# EAGLE design Aquila-2018 - コピー (EAGLE 9.1.1)
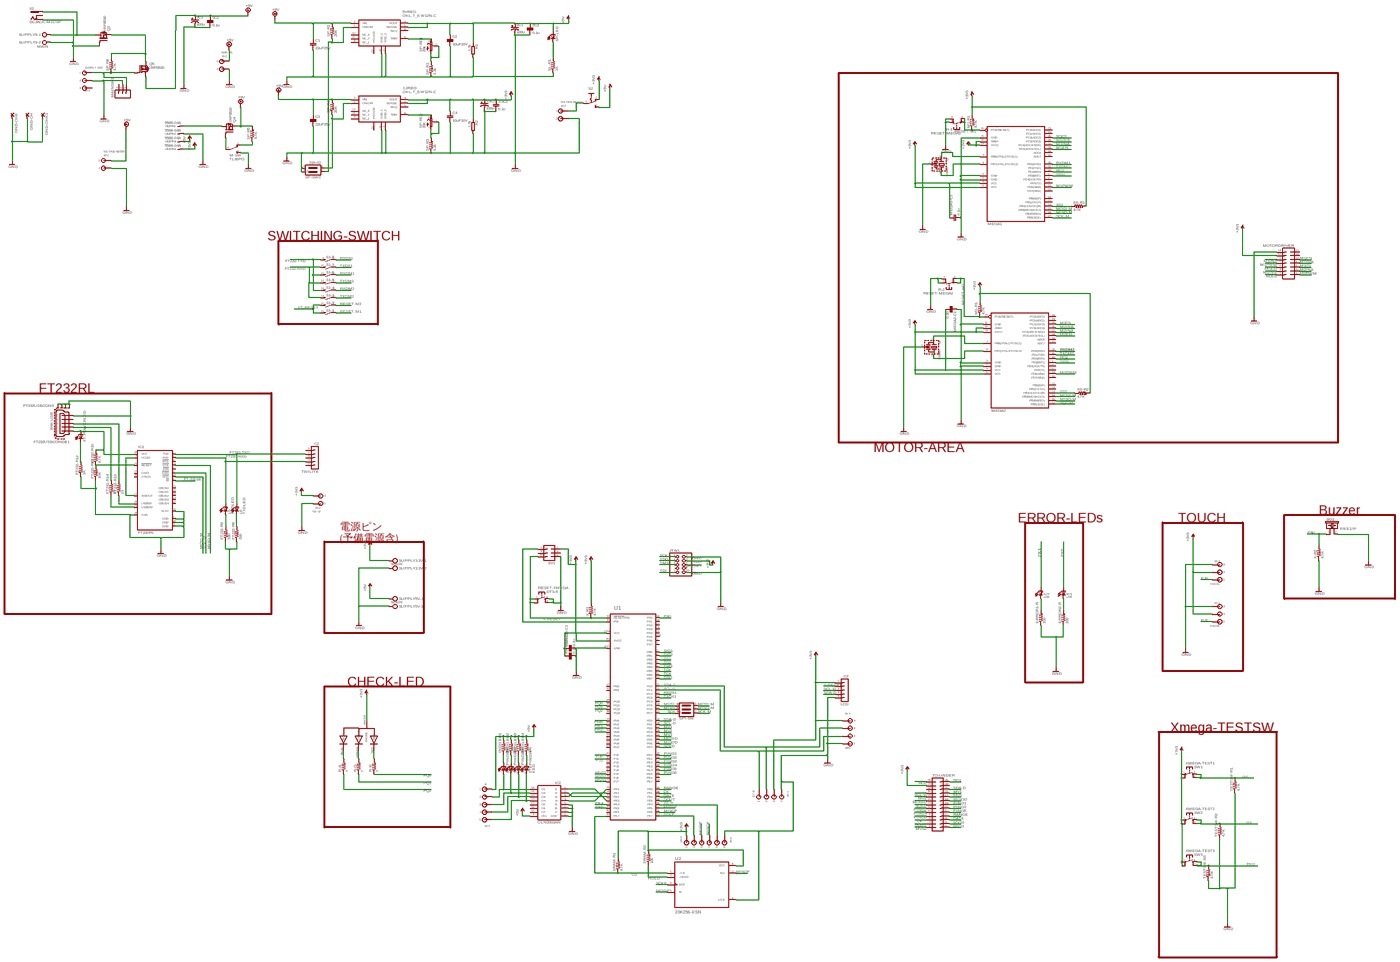
[diagram p0: schematic, sheet 1, overview]
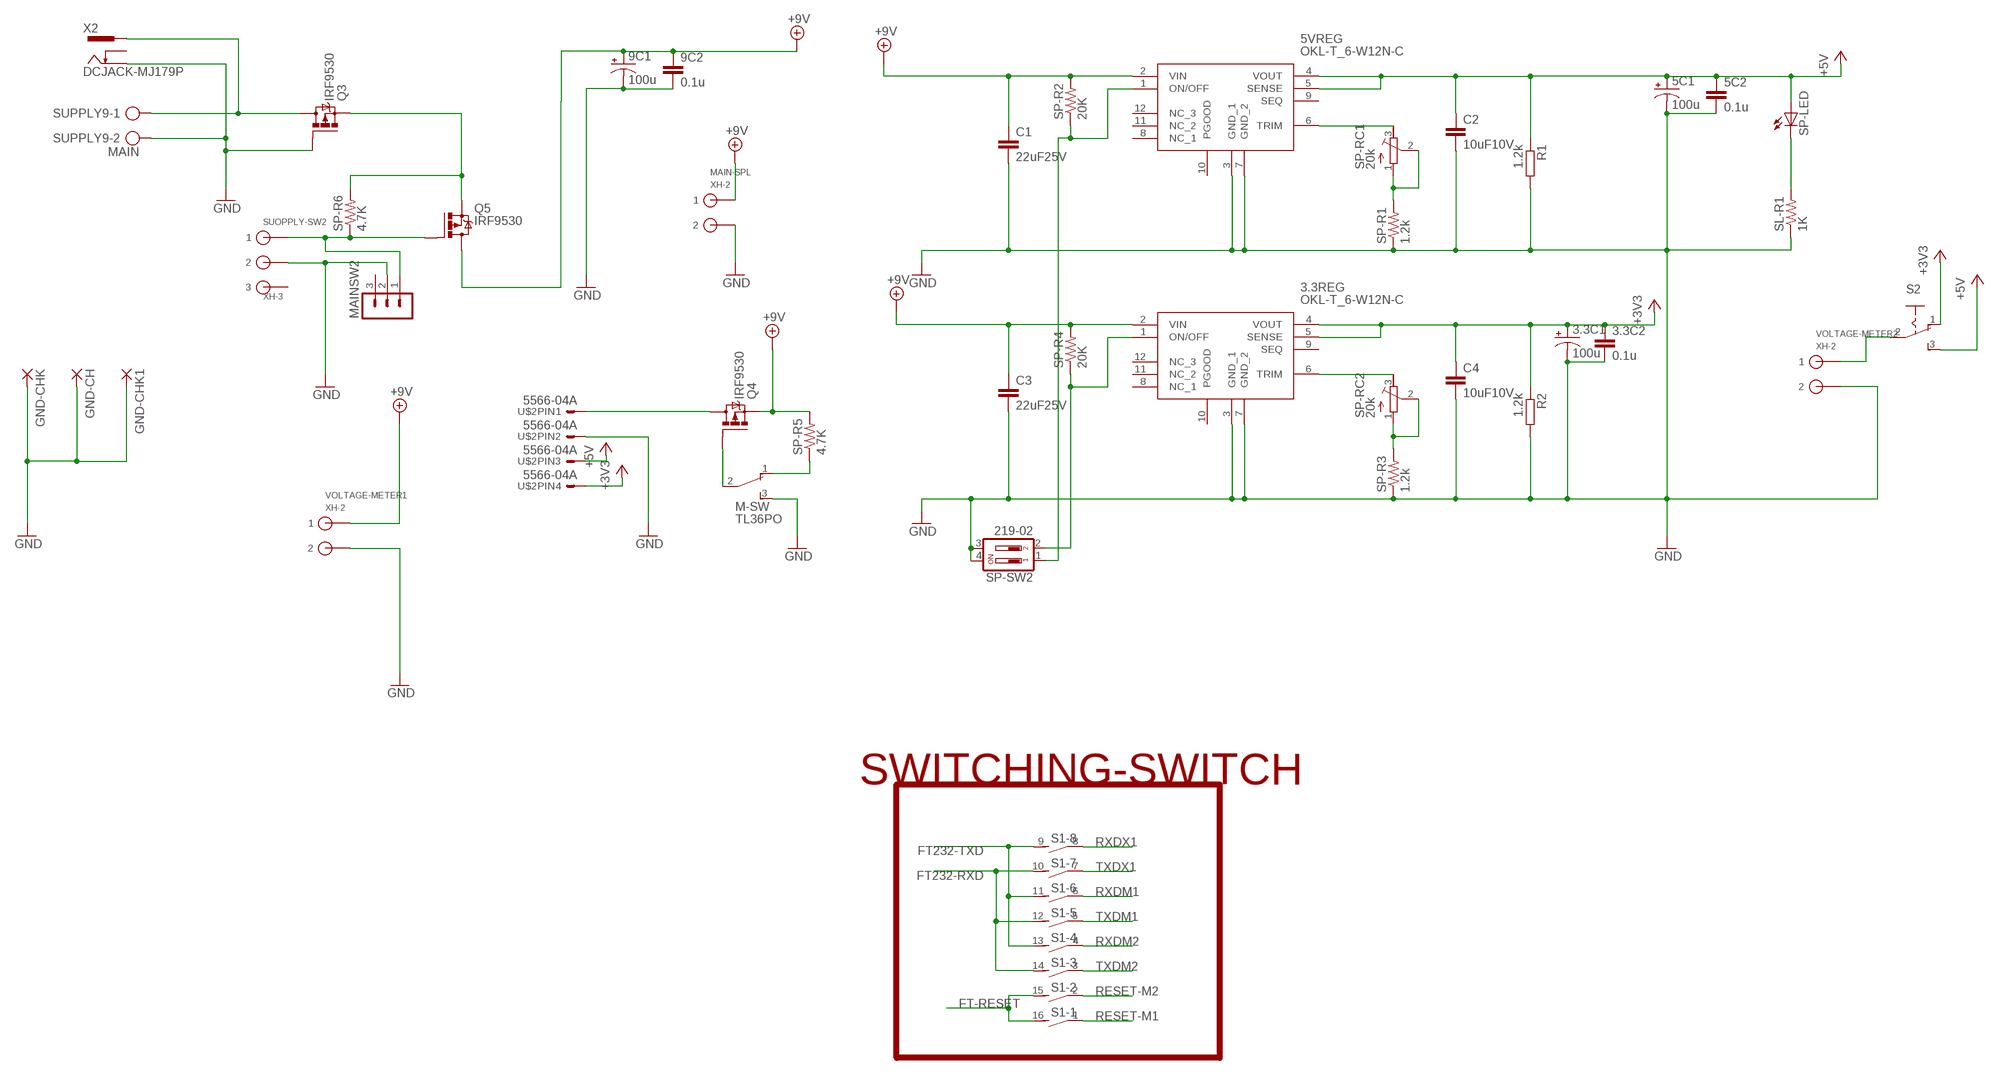
[diagram p1: schematic, sheet 1, part 1 of 5]
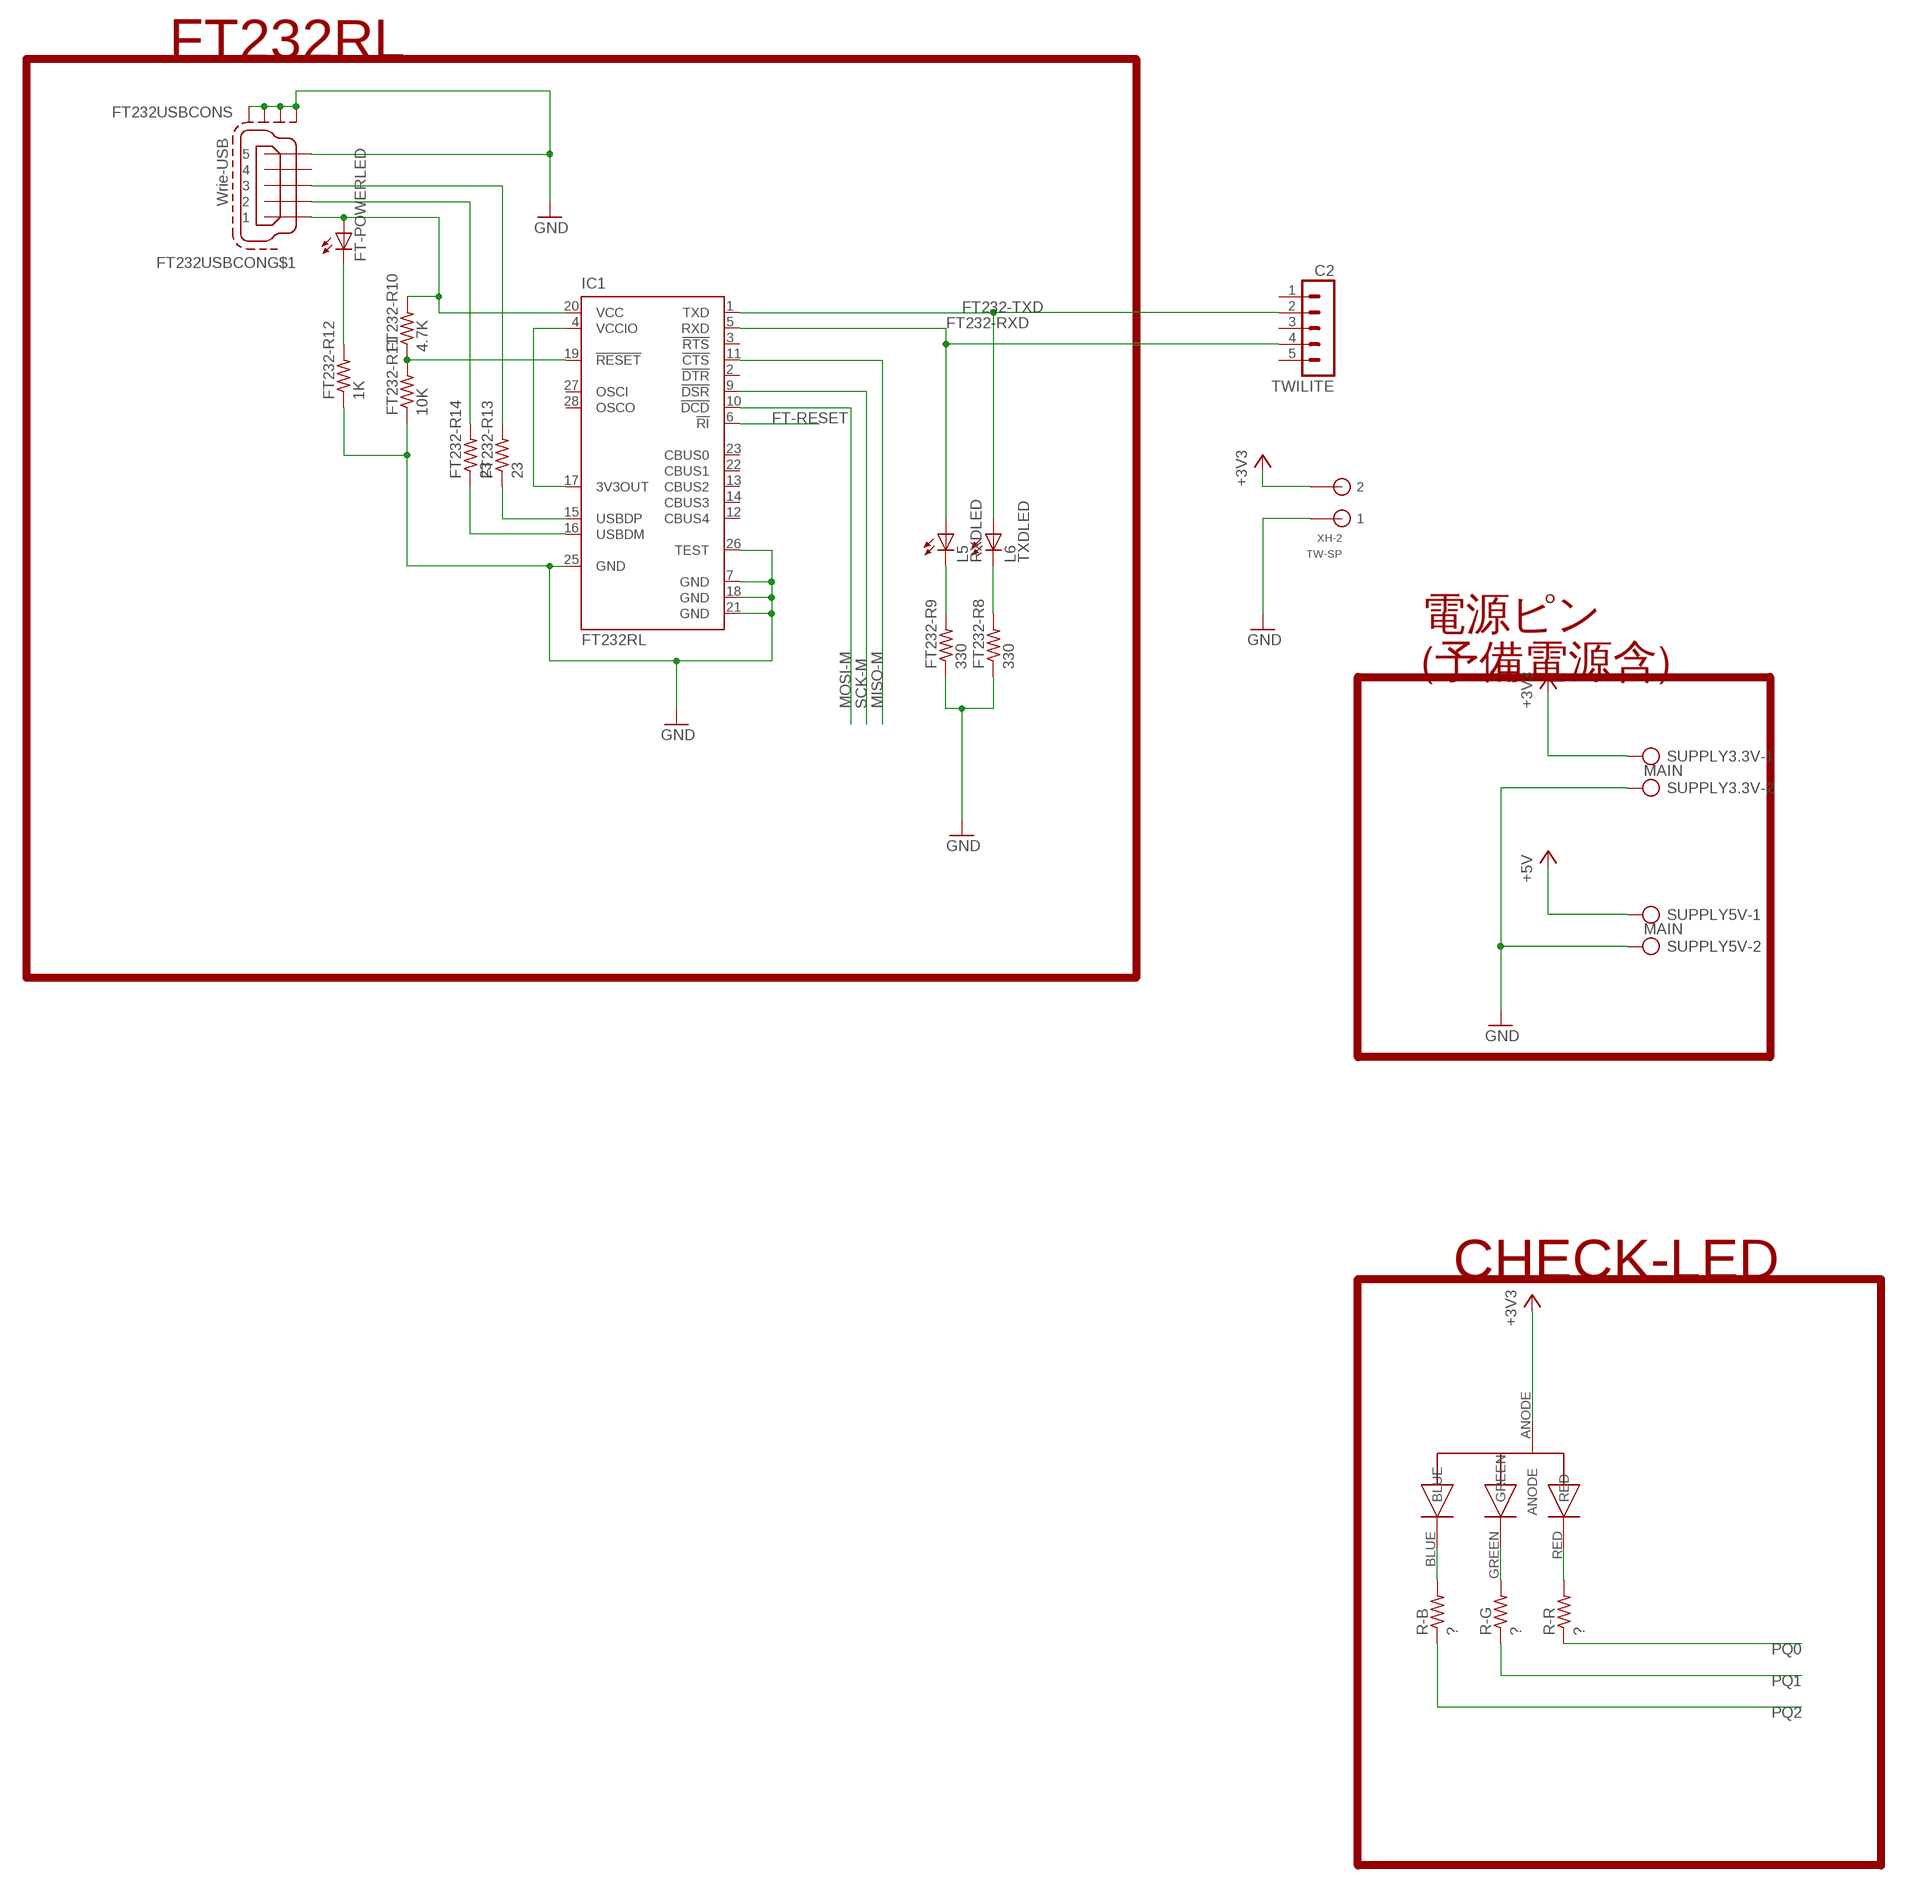
[diagram p2: schematic, sheet 1, part 2 of 5]
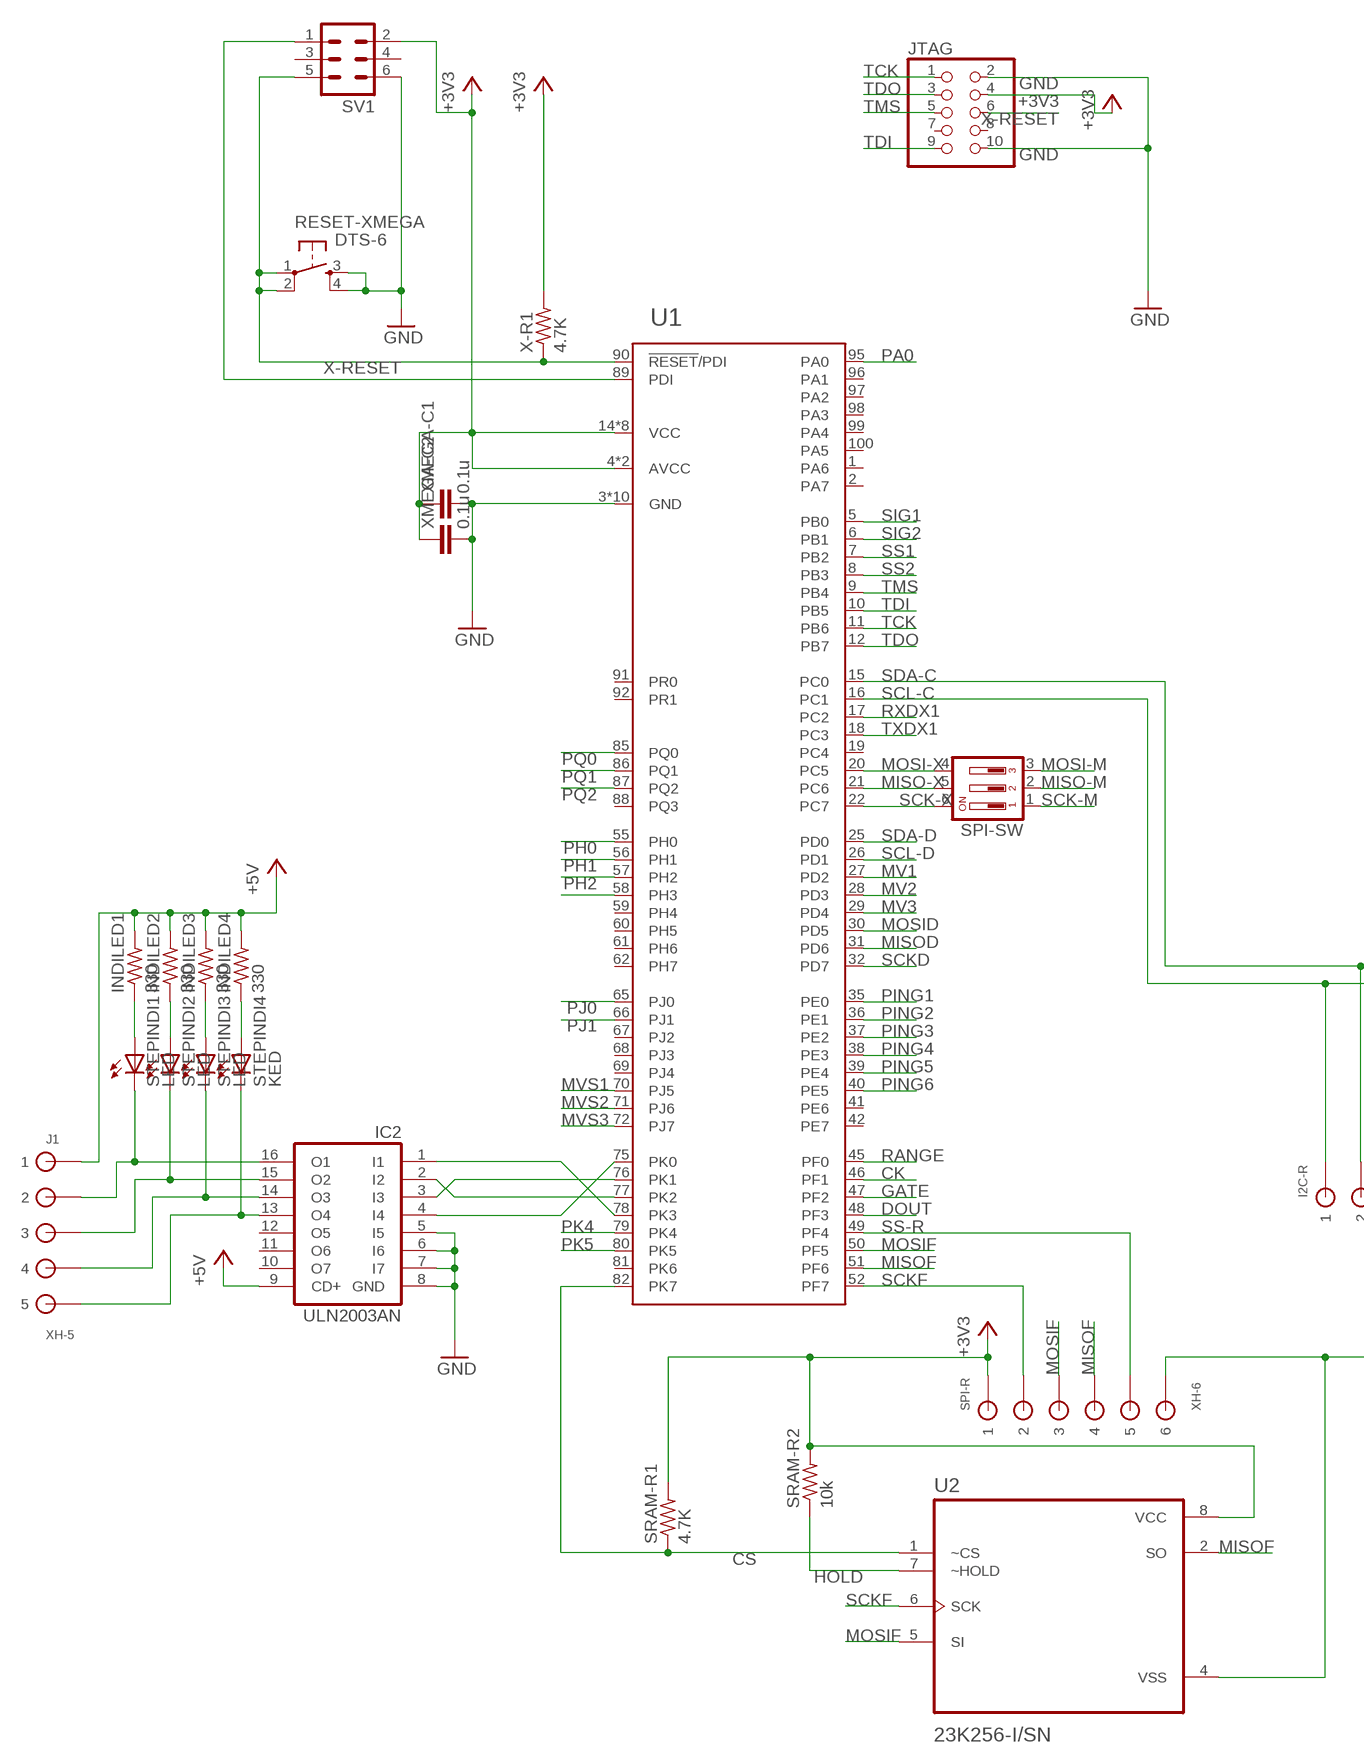
[diagram p3: schematic, sheet 1, part 3 of 5]
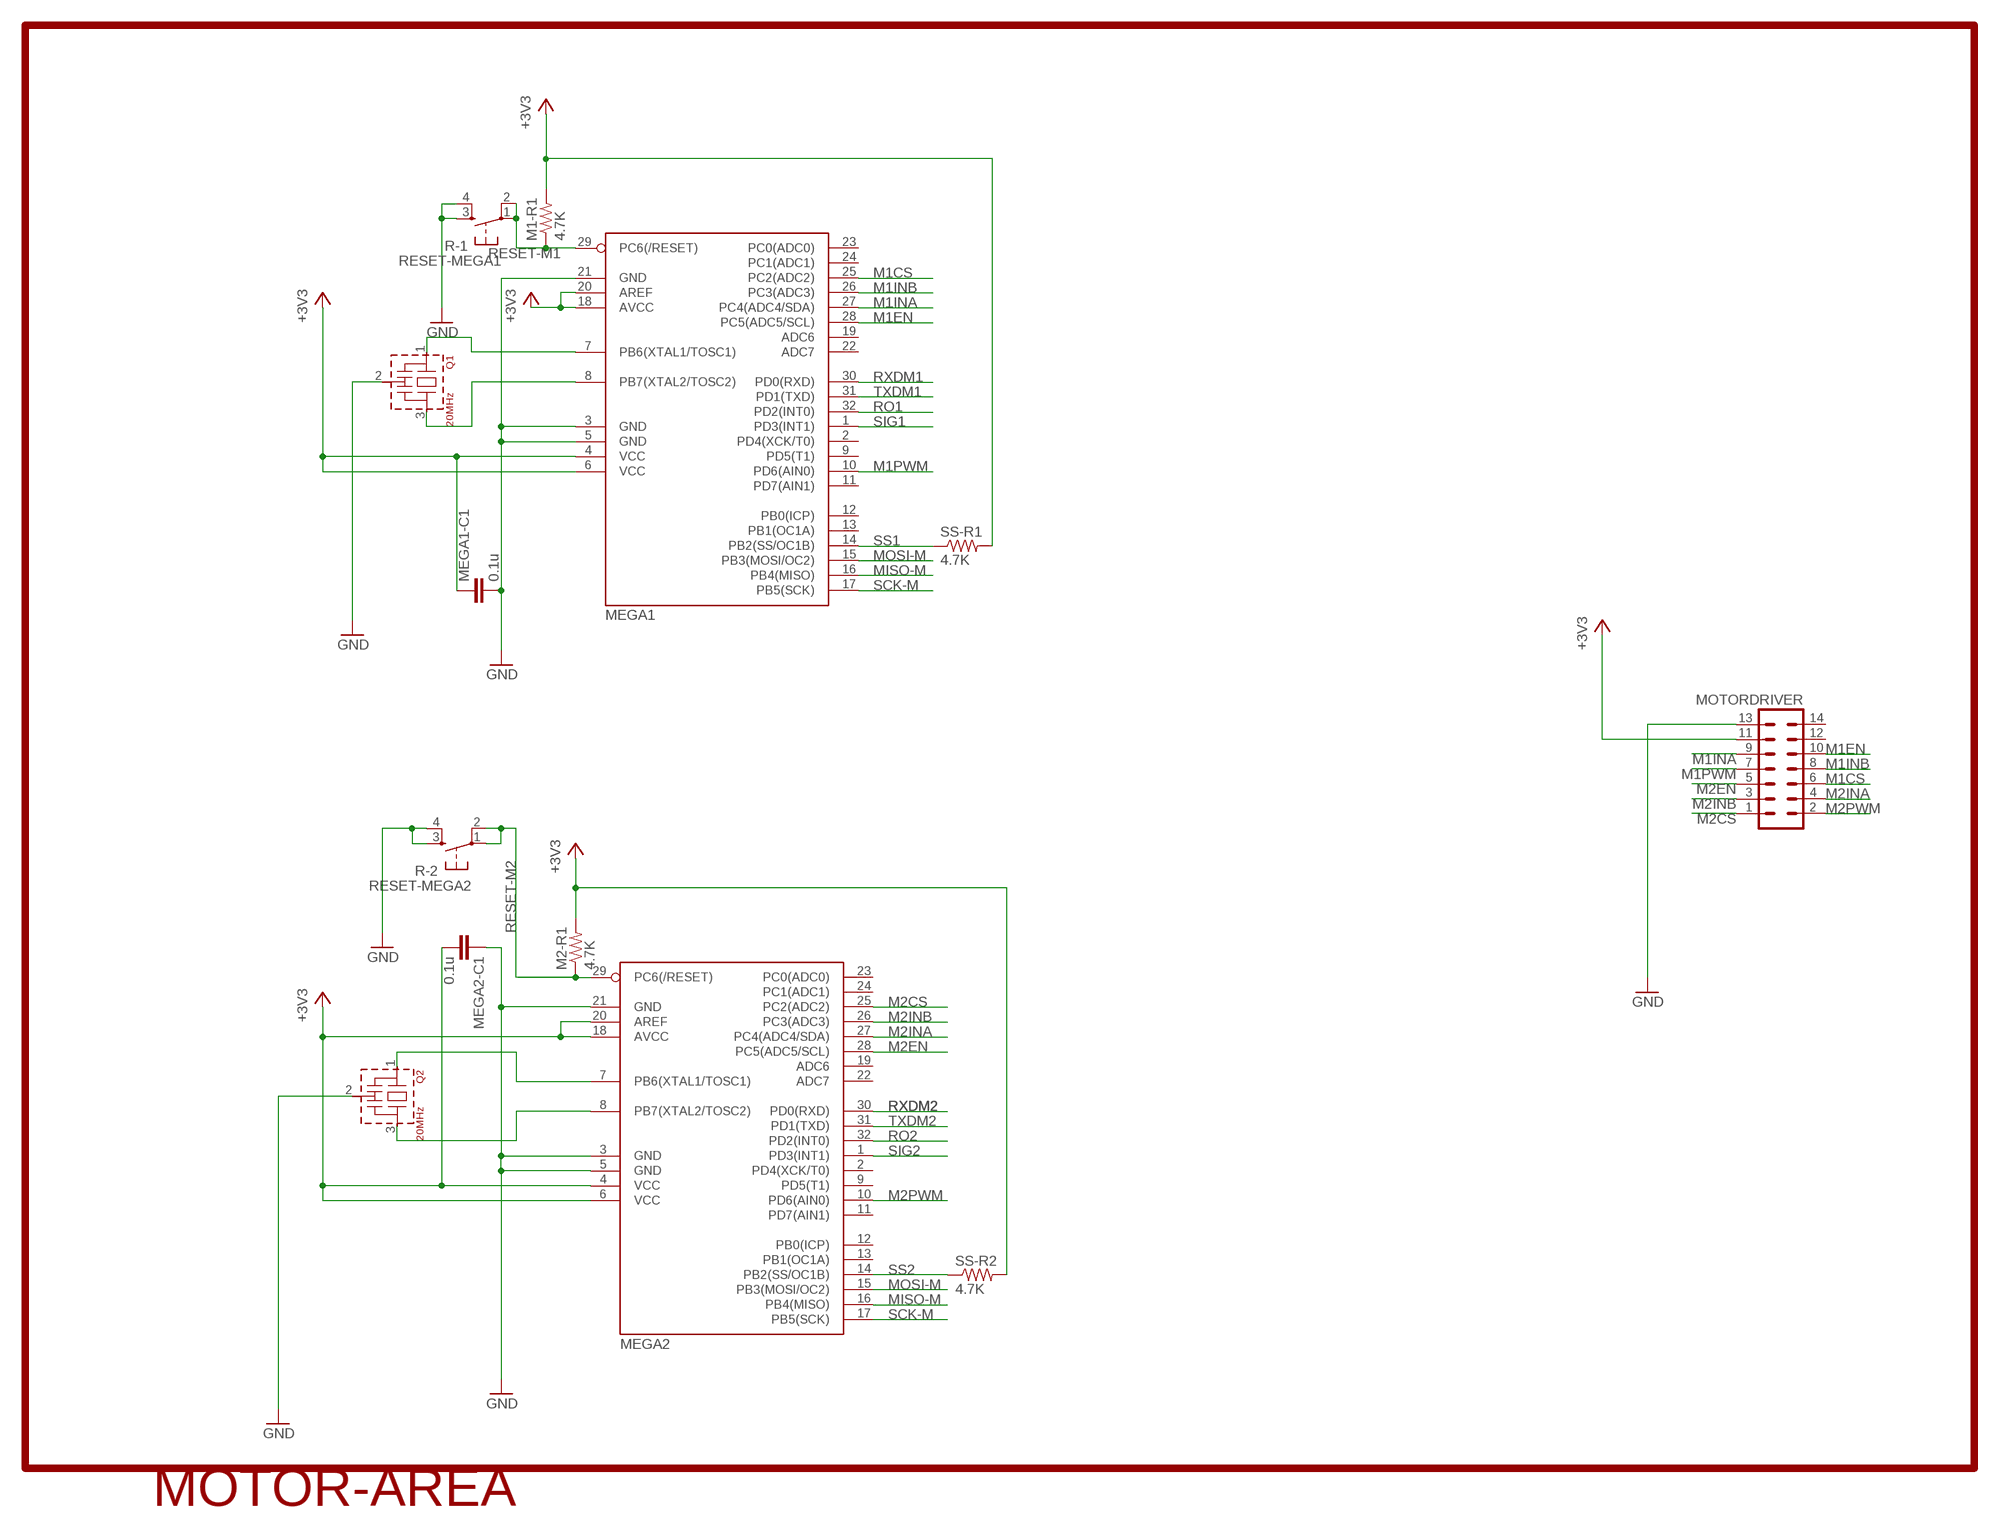
[diagram p4: schematic, sheet 1, part 4 of 5]
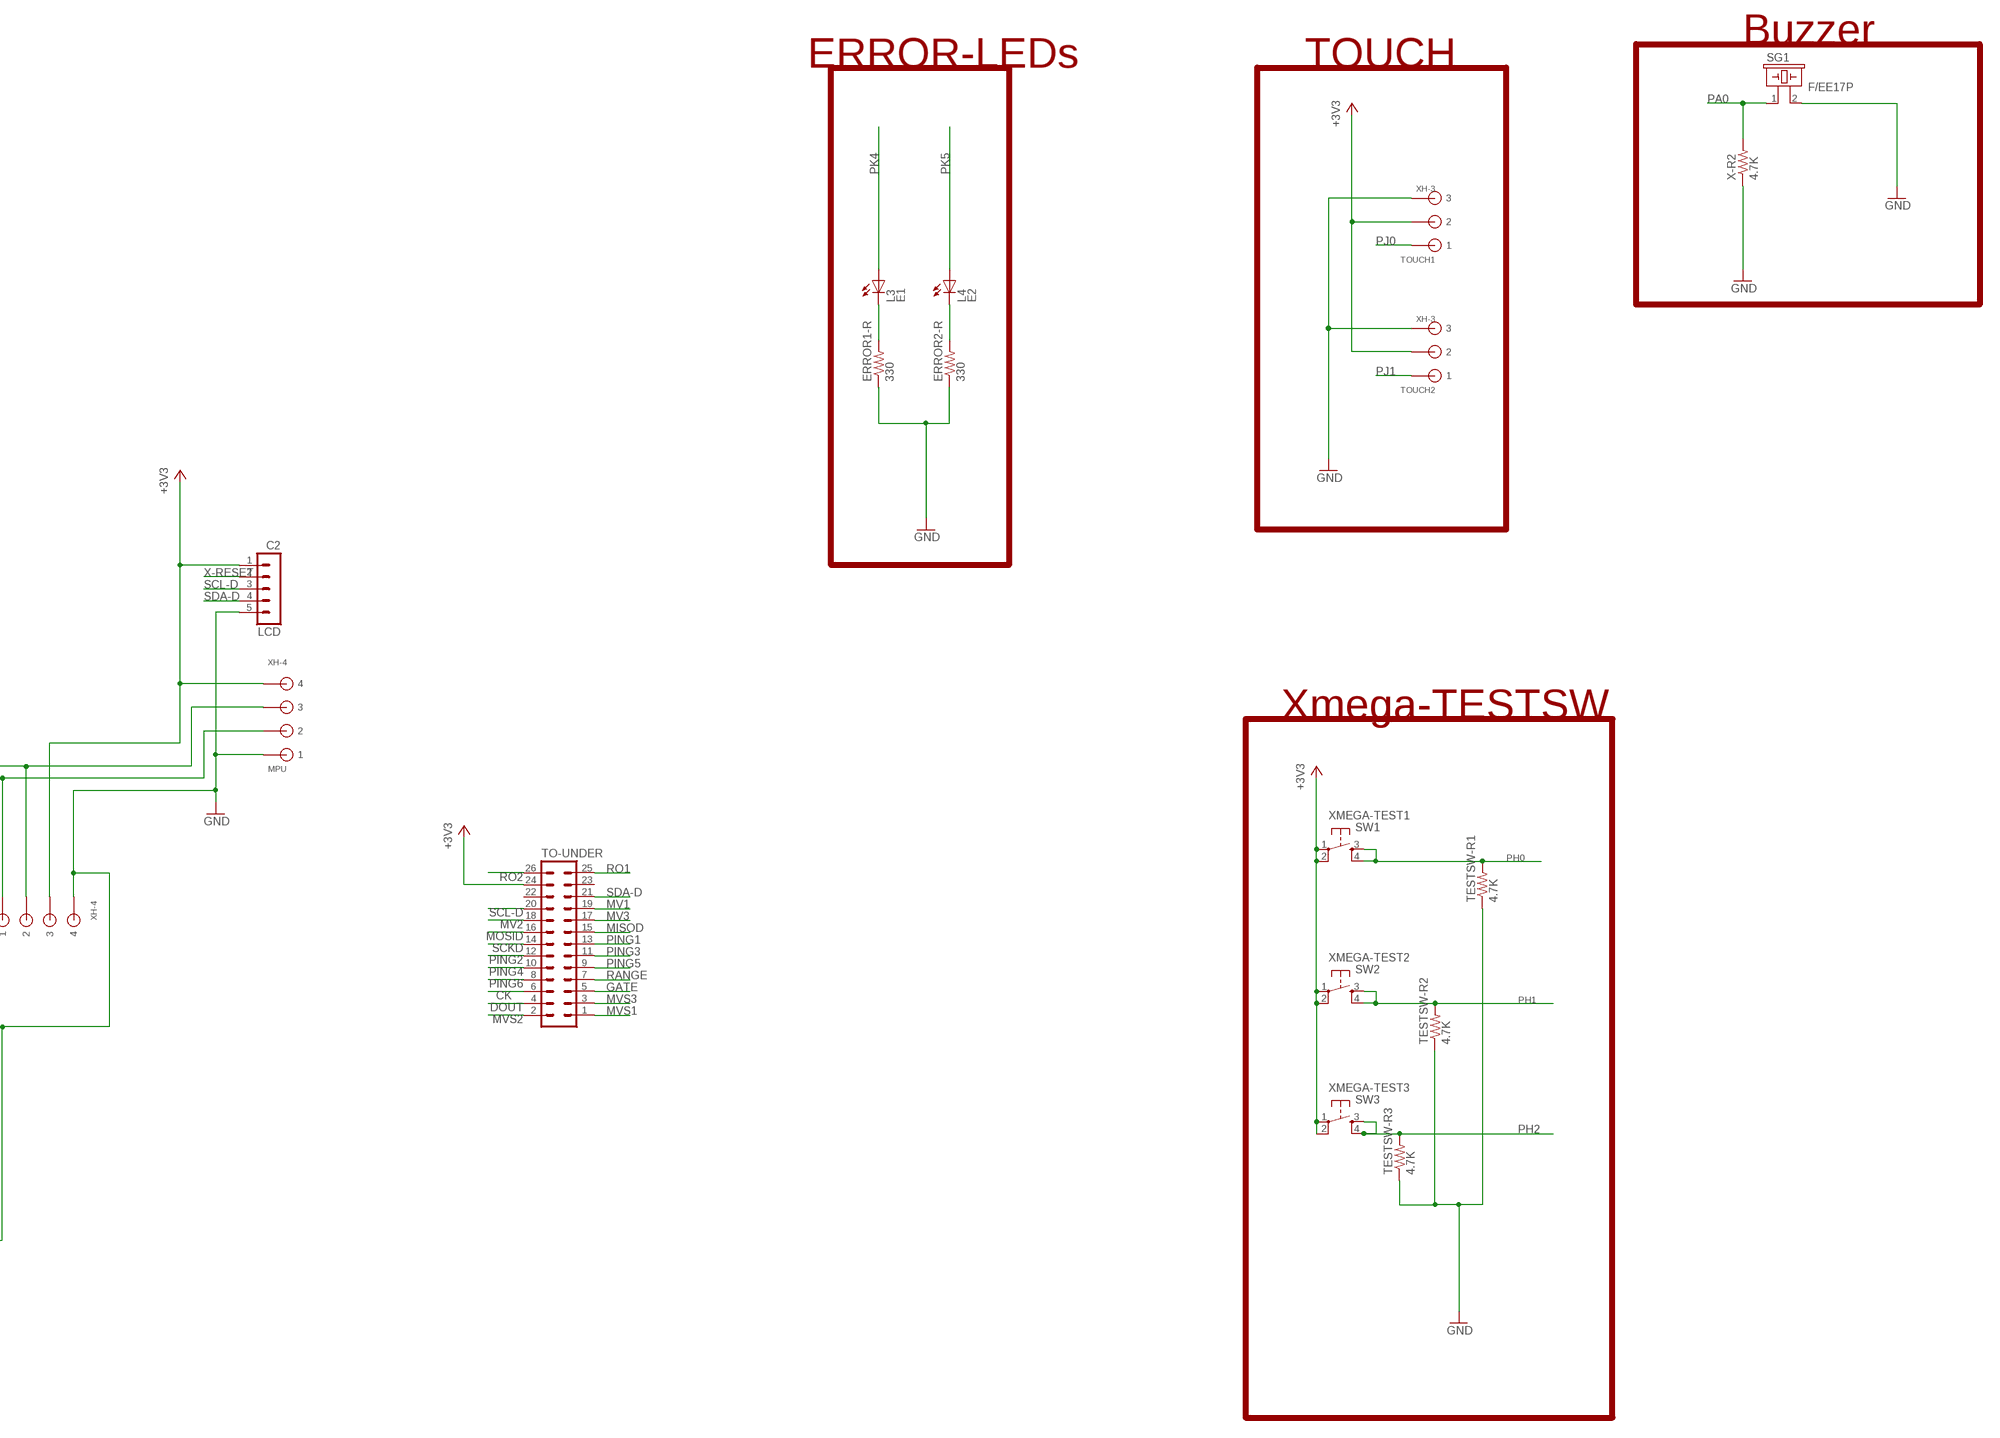
[diagram p5: schematic, sheet 1, part 5 of 5]

## Parts
3.3C1  100u  CPOL-USE2.5-6  [E2,5-6]
3.3C2  0.1u  C-EUC0805  [C0805]
3.3REG  OKL-T_6-W12N-C  [OKL-T/3-W5]
5C1  100u  CPOL-USE2.5-6  [E2,5-6]
5C2  0.1u  C-EUC0805  [C0805]
5VREG  OKL-T_6-W12N-C  [OKL-T/3-W5]
9C1  100u  CPOL-USE2.5-6  [E2,5-6]
9C2  0.1u  C-EUC0805  [C0805]
C1  22uF25V  C-EUC2012  [C2012]
C2  10uF10V  C-EUC2012  [C2012]
C3  22uF25V  C-EUC2012  [C2012]
C4  10uF10V  C-EUC2012  [C2012]
CHECKLED  OSTA71A1D-A  [OSTA71A1D-A]
ERROR1-R  330  R-US_R0805  [R0805]
ERROR2-R  330  R-US_R0805  [R0805]
FT232-R8  330  R-US_R0805  [R0805]
FT232-R9  330  R-US_R0805  [R0805]
FT232-R10  4.7K  R-US_R0805  [R0805]
FT232-R11  10K  R-US_R0805  [R0805]
FT232-R12  1K  R-US_R0805  [R0805]
FT232-R13  23  R-US_R0805  [R0805]
FT232-R14  23  R-US_R0805  [R0805]
FT232USBCON  Wrie-USB  MINI-USB-SCHIELD-32005-201  [32005-201]
FT-POWERLED  LEDCHIPLED_0805  [CHIPLED_0805]
GND-CH  SMD5  [SMD2,54-5,08]
GND-CHK  2,15/1,0  [2,15/1,0]
GND-CHK1  2,15/1,0  [2,15/1,0]
I2C-R  XH-4  [CON4]
IC1  FT232RL  [SSOP28]
IC2  ULN2003AN  [DIL16]
INDILED1  330  R-US_R0805  [R0805]
INDILED2  330  R-US_R0805  [R0805]
INDILED3  330  R-US_R0805  [R0805]
INDILED4  330  R-US_R0805  [R0805]
J1  XH-5  [CON5]
JTAG  20021221-00010C4LF  [20021221-00010C4LF]
L3  E1  LED5MM  [LED5MM]
L4  E2  LED5MM  [LED5MM]
L5  RXDLED  LEDCHIPLED_0805  [CHIPLED_0805]
L6  TXDLED  LEDCHIPLED_0805  [CHIPLED_0805]
LCD  C2  MA05-1  [MA05-1]
M1-R1  4.7K  R-US_R0805  [R0805]
M2-R1  4.7K  R-US_R0805  [R0805]
M-SW  TL36PO  [TL3XPO]
MAIN-SPL  XH-2  [CON2]
MAINSW2  MA03-1  [MA03-1]
MEGA1  MEGA8-AI  [TQFP32-08]
MEGA1-C1  0.1u  C-EUC0805  [C0805]
MEGA2  MEGA8-AI  [TQFP32-08]
MEGA2-C1  0.1u  C-EUC0805  [C0805]
MOTORDRIVER  ML14  [ML14]
MPU  XH-4  [CON4]
Q1  20MHz  CSTLS_X  [CSTLS_X]
Q2  20MHz  CSTLS_X  [CSTLS_X]
Q3  IRF9530  [TO220BV]
Q4  IRF9530  [TO220BV]
Q5  IRF9530  [TO220BV]
R1  1.2k  R-EU_0204/7  [0204/7]
R2  1.2k  R-EU_0204/7  [0204/7]
R-B  ?  R-US_R0805  [R0805]
R-G  ?  R-US_R0805  [R0805]
R-R  ?  R-US_R0805  [R0805]
RESET-MEGA1  R-1  DTS-6  [DTS-6]
RESET-MEGA2  R-2  DTS-6  [DTS-6]
RESET-XMEGA  DTS-6  [DTS-6]
S1  DIP08S  [DIP08S]
S2  M251  [M251]
SG1  F/EE17P  [F/EE17P]
SL-R1  1K  R-US_R0805  [R0805]
SP-LED  LEDCHIPLED_0805  [CHIPLED_0805]
SP-R1  1.2k  R-US_R0805  [R0805]
SP-R2  20K  R-US_R0805  [R0805]
SP-R3  1.2k  R-US_R0805  [R0805]
SP-R4  20K  R-US_R0805  [R0805]
SP-R5  4.7K  R-US_R0805  [R0805]
SP-R6  4.7K  R-US_R0805  [R0805]
SP-RC1  20k  R-TRIMM3296W  [RTRIM3296W]
SP-RC2  20k  R-TRIMM3296W  [RTRIM3296W]
SP-SW2  219-02  [CTS-219-02]
SPI-R  XH-6  [CON6]
SPI-SW  DIP03YL  [DIP03YL]
SRAM-R1  4.7K  R-US_R0805  [R0805]
SRAM-R2  10k  R-US_R0805  [R0805]
SS-R1  4.7K  R-US_R0805  [R0805]
SS-R2  4.7K  R-US_R0805  [R0805]
STEPINDI1  LED  LEDCHIPLED_0805  [CHIPLED_0805]
STEPINDI2  LED  LEDCHIPLED_0805  [CHIPLED_0805]
STEPINDI3  LED  LEDCHIPLED_0805  [CHIPLED_0805]
STEPINDI4  KED  LEDCHIPLED_0805  [CHIPLED_0805]
SUOPPLY-SW2  XH-3  [CON3]
SUPPLY3.3V  MAIN  AK500/2  [AK500/2]
SUPPLY5V  MAIN  AK500/2  [AK500/2]
SUPPLY9  MAIN  AK500/2  [AK500/2]
SV1  ML6  [ML6]
TESTSW-R1  4.7K  R-US_R0805  [R0805]
TESTSW-R2  4.7K  R-US_R0805  [R0805]
TESTSW-R3  4.7K  R-US_R0805  [R0805]
TO-UNDER  ML26  [ML26]
TOUCH1  XH-3  [CON3]
TOUCH2  XH-3  [CON3]
TW-SP  XH-2  [CON2]
TWILITE  C2  MA05-1  [MA05-1]
U1  ATXMEGA128A1U-AU  [TQFP-100A-100]
U2  23K256-I/SN  [SOIC127P600X175-8N]
U$2  5566-04A  [5566-04A]
VOLTAGE-METER1  XH-2  [CON2]
VOLTAGE-METER2  XH-2  [CON2]
X2  DCJACK-MJ179P  [MJ-179P]
X-R1  4.7K  R-US_R0805  [R0805]
X-R2  4.7K  R-US_R0805  [R0805]
XMEGA-C1  0.1u  C-EUC0805  [C0805]
XMEGA-C2  0.1u  C-EUC0805  [C0805]
XMEGA-TEST1  SW1  DTS-6  [DTS-6]
XMEGA-TEST2  SW2  DTS-6  [DTS-6]
XMEGA-TEST3  SW3  DTS-6  [DTS-6]

## Nets
+3V3: 3.3C1.+ 3.3C2.1 3.3REG.4(VOUT) 3.3REG.5(SENSE) C4.1 CHECKLED.ANODE I2C-R.P$3 JTAG.4 LCD.1 M1-R1.2 M2-R1.2 MEGA1-C1.1 MEGA1.4(VCC) MEGA1.6(VCC) MEGA1.18(AVCC) MEGA1.20(AREF) MEGA2-C1.2 MEGA2.4(VCC) MEGA2.6(VCC) MEGA2.18(AVCC) MEGA2.20(AREF) MOTORDRIVER.11 MPU.P$4 R2.1 S2.1(O) SPI-R.P$1 SRAM-R1.2 SRAM-R2.2 SS-R1.2 SS-R2.2 SUPPLY3.3V.1 SV1.2 TO-UNDER.24 TOUCH1.P$2 TOUCH2.P$2 TW-SP.P$2 U1.4(AVCC) U1.14(VCC) U1.24(VCC) U1.34(VCC) U1.44(VCC) U1.54(VCC) U1.64(VCC) U1.74(VCC) U1.83(VCC) U1.94(AVCC) U2.8(VCC) U$2.4 X-R1.2 XMEGA-C1.1 XMEGA-C2.1 XMEGA-TEST1.1 XMEGA-TEST1.2 XMEGA-TEST2.1 XMEGA-TEST2.2 XMEGA-TEST3.1 XMEGA-TEST3.2
+5V: 5C1.+ 5C2.1 5VREG.4(VOUT) 5VREG.5(SENSE) C2.1 IC2.9(CD+) INDILED1.2 INDILED2.2 INDILED3.2 INDILED4.2 J1.P$1 R1.1 S2.3(S) SP-LED.A SUPPLY5V.1 U$2.3
+9V: 3.3REG.2(VIN) 5VREG.2(VIN) 9C1.+ 9C2.1 C1.1 C3.1 MAIN-SPL.P$1 Q4.S Q5.D SP-R2.2 SP-R4.2 SP-R5.2 VOLTAGE-METER1.P$1
CK: TO-UNDER.6 U1.46(PF1)
CS: SRAM-R1.1 U1.82(PK7) U2.1(~CS)
DOUT: TO-UNDER.4 U1.48(PF3)
FT232-RXD: IC1.5(RXD) L5.A S1.10 S1.12 S1.14 TWILITE.4
FT232-TXD: IC1.1(TXD) L6.A S1.9 S1.11 S1.13 TWILITE.2
FT-POWERLED1: FT232-R12.2 FT-POWERLED.C
FT-RESET: IC1.6(!RI) S1.15 S1.16
GATE: TO-UNDER.5 U1.47(PF2)
GND: 3.3C1.- 3.3C2.2 3.3REG.3(GND_1) 3.3REG.7(GND_2) 5C1.- 5C2.2 5VREG.3(GND_1) 5VREG.7(GND_2) 9C1.- 9C2.2 C1.2 C2.2 C3.2 C4.2 ERROR1-R.1 ERROR2-R.1 FT232-R8.1 FT232-R9.1 FT232-R11.1 FT232-R12.1 FT232USBCON.5 FT232USBCON.M1(S:S1) FT232USBCON.M2(S:S2) FT232USBCON.M3(S:S3) FT232USBCON.M4(S:S4) GND-CH.1(P) GND-CHK1.1(P) GND-CHK.1(P) I2C-R.P$4 IC1.7(GND) IC1.18(GND) IC1.21(GND) IC1.25(GND) IC1.26(TEST) IC2.5(I5) IC2.6(I6) IC2.7(I7) IC2.8(GND) JTAG.2 JTAG.10 LCD.5 M-SW.3(S) MAIN-SPL.P$2 MAINSW2.2 MEGA1-C1.2 MEGA1.3(GND) MEGA1.5(GND) MEGA1.21(GND) MEGA2-C1.1 MEGA2.3(GND) MEGA2.5(GND) MEGA2.21(GND) MOTORDRIVER.13 MPU.P$1 Q1.2(VSS) Q2.2(VSS) Q3.G R1.2 R2.2 RESET-MEGA1.3 RESET-MEGA1.4 RESET-MEGA2.3 RESET-MEGA2.4 RESET-XMEGA.3 RESET-XMEGA.4 SG1.2 SL-R1.1 SP-R1.1 SP-R3.1 SP-SW2.3 SP-SW2.4 SPI-R.P$6 SUOPPLY-SW2.P$2 SUPPLY3.3V.2 SUPPLY5V.2 SUPPLY9.2 SV1.6 TESTSW-R1.1 TESTSW-R2.1 TESTSW-R3.1 TOUCH1.P$3 TOUCH2.P$3 TW-SP.P$1 U1.3(GND) U1.13(GND) U1.23(GND) U1.33(GND) U1.43(GND) U1.53(GND) U1.63(GND) U1.73(GND) U1.84(GND) U1.93(GND) U2.4(VSS) U$2.2 VOLTAGE-METER1.P$2 VOLTAGE-METER2.P$2 X2.2 X-R2.1 XMEGA-C1.2 XMEGA-C2.2
HOLD: SRAM-R2.1 U2.7(~HOLD)
M1CS: MEGA1.25(PC2(ADC2)) MOTORDRIVER.6
M1EN: MEGA1.28(PC5(ADC5/SCL)) MOTORDRIVER.10
M1INA: MEGA1.27(PC4(ADC4/SDA)) MOTORDRIVER.9
M1INB: MEGA1.26(PC3(ADC3)) MOTORDRIVER.8
M1PWM: MEGA1.10(PD6(AIN0)) MOTORDRIVER.7
M2CS: MEGA2.25(PC2(ADC2)) MOTORDRIVER.1
M2EN: MEGA2.28(PC5(ADC5/SCL)) MOTORDRIVER.5
M2INA: MEGA2.27(PC4(ADC4/SDA)) MOTORDRIVER.4
M2INB: MEGA2.26(PC3(ADC3)) MOTORDRIVER.3
M2PWM: MEGA2.10(PD6(AIN0)) MOTORDRIVER.2
MISO-M: IC1.11(!CTS) MEGA1.16(PB4(MISO)) MEGA2.16(PB4(MISO)) SPI-SW.2
MISO-X: SPI-SW.5 U1.21(PC6)
MISOD: TO-UNDER.15 U1.31(PD6)
MISOF: SPI-R.P$4 U1.51(PF6) U2.2(SO)
MOSI-M: IC1.10(!DCD) MEGA1.15(PB3(MOSI/OC2)) MEGA2.15(PB3(MOSI/OC2)) SPI-SW.3
MOSI-X: SPI-SW.4 U1.20(PC5)
MOSID: TO-UNDER.16 U1.30(PD5)
MOSIF: SPI-R.P$3 U1.50(PF5) U2.5(SI)
MV1: TO-UNDER.19 U1.27(PD2)
MV2: TO-UNDER.18 U1.28(PD3)
MV3: TO-UNDER.17 U1.29(PD4)
MVS1: TO-UNDER.1 U1.70(PJ5)
MVS2: TO-UNDER.2 U1.71(PJ6)
MVS3: TO-UNDER.3 U1.72(PJ7)
N$1: IC2.4(I4) U1.75(PK0)
N$2: U1.58(PH3)
N$3: SP-R1.2 SP-RC1.1(A) SP-RC1.2(S)
N$4: IC2.3(I3) U1.76(PK1)
N$5: Q3.S Q5.S SP-R6.2
N$6: Q4.D U$2.1
N$7: SP-R3.2 SP-RC2.1(A) SP-RC2.2(S)
N$8: M-SW.2(P) Q4.G
N$9: 5VREG.6(TRIM) SP-RC1.3(E)
N$10: M-SW.1(O) SP-R5.1
N$11: S2.2(P) VOLTAGE-METER2.P$1
N$12: IC2.2(I2) U1.77(PK2)
N$13: 3.3REG.6(TRIM) SP-RC2.3(E)
N$14: IC2.1(I1) U1.78(PK3)
N$15: 3.3REG.1(ON/OFF) SP-R4.1 SP-SW2.2
N$16: IC2.16(O1) J1.P$2 STEPINDI1.C
N$17: IC2.15(O2) J1.P$3 STEPINDI2.C
N$18: IC2.14(O3) J1.P$4 STEPINDI3.C
N$19: IC2.13(O4) J1.P$5 STEPINDI4.C
N$20: INDILED4.1 STEPINDI4.A
N$21: INDILED3.1 STEPINDI3.A
N$22: INDILED2.1 STEPINDI2.A
N$23: INDILED1.1 STEPINDI1.A
N$24: SL-R1.2 SP-LED.C
N$26: 5VREG.1(ON/OFF) SP-R2.1 SP-SW2.1
N$31: MEGA2.7(PB6(XTAL1/TOSC1)) Q2.1
N$33: MEGA2.8(PB7(XTAL2/TOSC2)) Q2.3
N$36: MEGA1.7(PB6(XTAL1/TOSC1)) Q1.1
N$37: MEGA1.8(PB7(XTAL2/TOSC2)) Q1.3
N$38: Q3.D SUPPLY9.1 X2.1
N$40: MAINSW2.1 Q5.G SP-R6.1 SUOPPLY-SW2.P$1
N$42: FT232-R9.2 L5.C
N$43: FT232-R8.2 L6.C
N$44: FT232-R14.2 FT232USBCON.2
N$45: FT232-R10.2 FT232USBCON.1 FT-POWERLED.A IC1.20(VCC)
N$46: ERROR1-R.2 L3.K(C)
N$47: ERROR2-R.2 L4.K(C)
N$48: FT232-R10.1 FT232-R11.2 IC1.19(!RESET)
N$49: FT232-R13.2 FT232USBCON.3
N$50: FT232-R13.1 IC1.15(USBDP)
N$51: FT232-R14.1 IC1.16(USBDM)
N$55: IC1.4(VCCIO) IC1.17(3V3OUT)
N$56: CHECKLED.RED R-R.2
N$57: CHECKLED.GREEN R-G.2
N$58: CHECKLED.BLUE R-B.2
N$64: SV1.1 U1.89(PDI)
PA0: SG1.1 U1.95(PA0) X-R2.2
PH0: TESTSW-R1.2 U1.55(PH0) XMEGA-TEST1.3 XMEGA-TEST1.4
PH1: TESTSW-R2.2 U1.56(PH1) XMEGA-TEST2.3 XMEGA-TEST2.4
PH2: TESTSW-R3.2 U1.57(PH2) XMEGA-TEST3.3 XMEGA-TEST3.4
PING1: TO-UNDER.13 U1.35(PE0)
PING2: TO-UNDER.12 U1.36(PE1)
PING3: TO-UNDER.11 U1.37(PE2)
PING4: TO-UNDER.10 U1.38(PE3)
PING5: TO-UNDER.9 U1.39(PE4)
PING6: TO-UNDER.8 U1.40(PE5)
PJ0: TOUCH1.P$1 U1.65(PJ0)
PJ1: TOUCH2.P$1 U1.66(PJ1)
PK4: L3.A U1.79(PK4)
PK5: L4.A U1.80(PK5)
PQ0: R-R.1 U1.85(PQ0)
PQ1: R-G.1 U1.86(PQ1)
PQ2: R-B.1 U1.87(PQ2)
RANGE: TO-UNDER.7 U1.45(PF0)
RESET-M1: M1-R1.1 MEGA1.29(PC6(/RESET)) RESET-MEGA1.1 RESET-MEGA1.2 S1.1
RESET-M2: M2-R1.1 MEGA2.29(PC6(/RESET)) RESET-MEGA2.1 RESET-MEGA2.2 S1.2
RO1: MEGA1.32(PD2(INT0)) TO-UNDER.25
RO2: MEGA2.32(PD2(INT0)) TO-UNDER.26
RXDM1: MEGA1.30(PD0(RXD)) S1.6
RXDM2: MEGA2.30(PD0(RXD)) S1.4
RXDX1: S1.8 U1.17(PC2)
SCK-M: IC1.9(!DSR) MEGA1.17(PB5(SCK)) MEGA2.17(PB5(SCK)) SPI-SW.1
SCK-X: SPI-SW.6 U1.22(PC7)
SCKD: TO-UNDER.14 U1.32(PD7)
SCKF: SPI-R.P$2 U1.52(PF7) U2.6(SCK)
SCL-C: I2C-R.P$1 MPU.P$2 U1.16(PC1)
SCL-D: LCD.3 TO-UNDER.20 U1.26(PD1)
SDA-C: I2C-R.P$2 MPU.P$3 U1.15(PC0)
SDA-D: LCD.4 TO-UNDER.21 U1.25(PD0)
SIG1: MEGA1.1(PD3(INT1)) U1.5(PB0)
SIG2: MEGA2.1(PD3(INT1)) U1.6(PB1)
SS1: MEGA1.14(PB2(SS/OC1B)) SS-R1.1 U1.7(PB2)
SS2: MEGA2.14(PB2(SS/OC1B)) SS-R2.1 U1.8(PB3)
SS-R: SPI-R.P$5 U1.49(PF4)
TCK: JTAG.1 U1.11(PB6)
TDI: JTAG.9 U1.10(PB5)
TDO: JTAG.3 U1.12(PB7)
TMS: JTAG.5 U1.9(PB4)
TXDM1: MEGA1.31(PD1(TXD)) S1.5
TXDM2: MEGA2.31(PD1(TXD)) S1.3
TXDX1: S1.7 U1.18(PC3)
X-RESET: JTAG.6 LCD.2 RESET-XMEGA.1 RESET-XMEGA.2 SV1.5 U1.90(!RESET!/PDI) X-R1.1
Unconnected: 3.3REG.8(NC_1) 3.3REG.9(SEQ) 3.3REG.10(PGOOD) 3.3REG.11(NC_2) 3.3REG.12(NC_3) 5VREG.8(NC_1) 5VREG.9(SEQ) 5VREG.10(PGOOD) 5VREG.11(NC_2) 5VREG.12(NC_3) FT232USBCON.4 IC1.2(!DTR) IC1.3(!RTS) IC1.12(CBUS4) IC1.13(CBUS2) IC1.14(CBUS3) IC1.22(CBUS1) IC1.23(CBUS0) IC1.27(OSCI) IC1.28(OSCO) IC2.10(O7) IC2.11(O6) IC2.12(O5) JTAG.7 JTAG.8 MAINSW2.3 MEGA1.2(PD4(XCK/T0)) MEGA1.9(PD5(T1)) MEGA1.11(PD7(AIN1)) MEGA1.12(PB0(ICP)) MEGA1.13(PB1(OC1A)) MEGA1.19(ADC6) MEGA1.22(ADC7) MEGA1.23(PC0(ADC0)) MEGA1.24(PC1(ADC1)) MEGA2.2(PD4(XCK/T0)) MEGA2.9(PD5(T1)) MEGA2.11(PD7(AIN1)) MEGA2.12(PB0(ICP)) MEGA2.13(PB1(OC1A)) MEGA2.19(ADC6) MEGA2.22(ADC7) MEGA2.23(PC0(ADC0)) MEGA2.24(PC1(ADC1)) MOTORDRIVER.12 MOTORDRIVER.14 SUOPPLY-SW2.P$3 SV1.3 SV1.4 TO-UNDER.22 TO-UNDER.23 TWILITE.1 TWILITE.3 TWILITE.5 U1.1(PA6) U1.2(PA7) U1.19(PC4) U1.41(PE6) U1.42(PE7) U1.59(PH4) U1.60(PH5) U1.61(PH6) U1.62(PH7) U1.67(PJ2) U1.68(PJ3) U1.69(PJ4) U1.81(PK6) U1.88(PQ3) U1.91(PR0) U1.92(PR1) U1.96(PA1) U1.97(PA2) U1.98(PA3) U1.99(PA4) U1.100(PA5) X2.3

## Notes on the sheet
- SWITCHING-SWITCH
- FT232RL
- MOTOR-AREA
- Buzzer
- ERROR-LEDs | TOUCH
- 電源ピン
  (予備電源含)
- CHECK-LED
- Xmega-TESTSW

## Library data of the parts
3.3C1 5C1 9C1 = rcl:CPOL-US: POLARIZED CAPACITOR, American symbol; SPICEPREFIX: B
3.3C2 5C2 9C2 = rcl:C-EU: CAPACITOR, European symbol; SPICEPREFIX: B
3.3REG 5VREG = SamacSys_Parts:OKL-T_6-W12N-C: MURATA POWER SOLUTIONS - OKL-T/6-W12N-C - DC/DC CONVERTER, 30W, ADJ OUTPUT Source: Datasheet <http://www.mouser.com/ds/2/281/okl-t6-w12-21493.pdf>; ARROW_PART_NUMBER: OKL-T/6-W12N-C; ARROW_PRICE/STOCK: https://www.arrow.com/en/products/okl-t6-w12n-c/murata-power-solutions; DESCRIPTION: MURATA POWER SOLUTIONS - OKL-T/6-W12N-C - DC/DC CONVERTER, 30W, ADJ OUTPUT; HEIGHT: mm; MANUFACTURER_NAME: Murata Electronics; MANUFACTURER_PART_NUMBER: OKL-T/6-W12N-C; RS_PART_NUMBER: 1736944P; RS_PRICE/STOCK: http://uk.rs-online.com/web/p/products/1736944P
C1-C4 = resistor:C-EU: CAPACITOR, European symbol
CHECKLED = FullColorLed-forprint:OSTA71A1D-A
ERROR1-R ERROR2-R FT232-R8-FT232-R14 INDILED1-INDILED4 M1-R1 M2-R1 R-B R-G R-R SL-R1 SP-R1-SP-R6 SRAM-R1 SRAM-R2 SS-R1 SS-R2 TESTSW-R1-TESTSW-R3 X-R1 X-R2 = 0@Mylibrary-main1:R-US_: RESISTOR, American symbol
FT232USBCON = con-cypressindustries:MINI-USB-SCHIELD-: MINI USB-B Conector Source: www.cypressindustries.com; OC_FARNELL: unknown; OC_NEWARK: unknown
FT-POWERLED L5 L6 SP-LED STEPINDI1-STEPINDI4 = led:LED: LED OSRAM: - CHIPLED LG R971, LG N971, LY N971, LG Q971, LY Q971, LO R971, LY R971 LH N974, LH R974 LS Q976, LO Q976, LY Q976 LO Q996 - Hyper CHIPLED LW Q18S LB Q993, LB Q99A, LB R99A - SideLED LS A670, LO A670, LY A670, LG A670, LP A670 LB A673, LV A673, LT A673, LW A673 LH A674 LY A675 LS A676, LA A676, LO A676, LY A676, LW A676 LS A679, LY A679, LG A679 - Hyper Micro SIDELED® LS Y876, LA Y876, LO Y876, LY Y876 LT Y87S - SmartLED LW L88C, LW L88S LB L89C, LB L89S, LG L890 LS L89K, LO L89K, LY L89K LS L896, LA L896, LO L896, LY L896 - TOPLED LS T670, LO T670, LY T670, LG T670, LP T670 LSG T670, LSP T670, LSY T670, LOP T670, LYG T670 LG T671, LOG T671, LSG T671 LB T673, LV T673, LT T673, LW T673 LH T674 LS T676, LA T676, LO T676, LY T676, LB T676, LH T676, LSB T676, LW T676 LB T67C, LV T67C, LT T67C, LS T67K, LO T67K, LY T67K, LW E67C LS E67B, LA E67B, LO E67B, LY E67B, LB E67C, LV E67C, LT E67C LW T67C LS T679, LY T679, LG T679 LS T770, LO T770, LY T770, LG T770, LP T770 LB T773, LV T773, LT T773, LW T773 LH T774 LS E675, LA E675, LY E675, LS T675 LS T776, LA T776, LO T776, LY T776, LB T776 LHGB T686 LT T68C, LB T68C - Hyper Mini TOPLED® LB M676 - Mini TOPLED Santana® LG M470 LS M47K, LO M47K, LY M47K Source: http://www.osram.convergy.de LUXEON: - LUMILED® LXK2-PW12-R00, LXK2-PW12-S00, LXK2-PW14-U00, LXK2-PW14-V00 LXK2-PM12-R00, LXK2-PM12-S00, LXK2-PM14-U00 LXK2-PE12-Q00, LXK2-PE12-R00, LXK2-PE12-S00, LXK2-PE14-T00, LXK2-PE14-U00 LXK2-PB12-K00, LXK2-PB12-L00, LXK2-PB12-M00, LXK2-PB14-N00, LXK2-PB14-P00, LXK2-PB14-Q00 LXK2-PR12-L00, LXK2-PR12-M00, LXK2-PR14-Q00, LXK2-PR14-R00 LXK2-PD12-Q00, LXK2-PD12-R00, LXK2-PD12-S00 LXK2-PH12-R00, LXK2-PH12-S00 LXK2-PL12-P00, LXK2-PL12-Q00, LXK2-PL12-R00 Source: www.luxeon.com KINGBRIGHT: KA-3528ASYC Source: www.kingbright.com
GND-CH = wirepad:SMD5: SMD PAD
GND-CHK GND-CHK1 = wirepad:2,15/1,0: THROUGH-HOLE PAD
I2C-R MPU = 0@Mylibrary-main1:XH-4: Low insertion connector 4pin
IC1 = ftdichip:FT232R: Source: http://www.ftdichip.com/Documents/DataSheets/DS_FT232R_v104.pdf; MPN: FT232RL; OC_FARNELL: 1146032; OC_NEWARK: 91K9918
IC2 = ULN2003A:ULN2003A: DRIVER ARRAY; AVAILABILITY: Unavailable; DESCRIPTION: Trans Darlington NPN 50V 0.5A 16-Pin SOIC; MF: STMicroelectronics; MP: ULN2003A; PACKAGE: DIP-16 Rochester Electronics; PRICE: None
J1 = 0@Mylibrary-main1:XH-5: Low insertion connector 5P
JTAG = fci:20021221-00010C4LF: MINITEK 127 SHROUDED HDR Source: http://portal.fciconnect.com/Comergent//fci/drawing/20021221.pdf
L3 L4 = 0led:LED: LED OSRAM: - CHIPLED LG R971, LG N971, LY N971, LG Q971, LY Q971, LO R971, LY R971 LH N974, LH R974 LS Q976, LO Q976, LY Q976 LO Q996 - Hyper CHIPLED LW Q18S LB Q993, LB Q99A, LB R99A - SideLED LS A670, LO A670, LY A670, LG A670, LP A670 LB A673, LV A673, LT A673, LW A673 LH A674 LY A675 LS A676, LA A676, LO A676, LY A676, LW A676 LS A679, LY A679, LG A679 - Hyper Micro SIDELED® LS Y876, LA Y876, LO Y876, LY Y876 LT Y87S - SmartLED LW L88C, LW L88S LB L89C, LB L89S, LG L890 LS L89K, LO L89K, LY L89K LS L896, LA L896, LO L896, LY L896 - TOPLED LS T670, LO T670, LY T670, LG T670, LP T670 LSG T670, LSP T670, LSY T670, LOP T670, LYG T670 LG T671, LOG T671, LSG T671 LB T673, LV T673, LT T673, LW T673 LH T674 LS T676, LA T676, LO T676, LY T676, LB T676, LH T676, LSB T676, LW T676 LB T67C, LV T67C, LT T67C, LS T67K, LO T67K, LY T67K, LW E67C LS E67B, LA E67B, LO E67B, LY E67B, LB E67C, LV E67C, LT E67C LW T67C LS T679, LY T679, LG T679 LS T770, LO T770, LY T770, LG T770, LP T770 LB T773, LV T773, LT T773, LW T773 LH T774 LS E675, LA E675, LY E675, LS T675 LS T776, LA T776, LO T776, LY T776, LB T776 LHGB T686 LT T68C, LB T68C - Hyper Mini TOPLED® LB M676 - Mini TOPLED Santana® LG M470 LS M47K, LO M47K, LY M47K Source: http://www.osram.convergy.de LUXEON: - LUMILED® LXK2-PW12-R00, LXK2-PW12-S00, LXK2-PW14-U00, LXK2-PW14-V00 LXK2-PM12-R00, LXK2-PM12-S00, LXK2-PM14-U00 LXK2-PE12-Q00, LXK2-PE12-R00, LXK2-PE12-S00, LXK2-PE14-T00, LXK2-PE14-U00 LXK2-PB12-K00, LXK2-PB12-L00, LXK2-PB12-M00, LXK2-PB14-N00, LXK2-PB14-P00, LXK2-PB14-Q00 LXK2-PR12-L00, LXK2-PR12-M00, LXK2-PR14-Q00, LXK2-PR14-R00 LXK2-PD12-Q00, LXK2-PD12-R00, LXK2-PD12-S00 LXK2-PH12-R00, LXK2-PH12-S00 LXK2-PL12-P00, LXK2-PL12-Q00, LXK2-PL12-R00 Source: www.luxeon.com KINGBRIGHT: KA-3528ASYC Source: www.kingbright.com
LCD TWILITE = con-lstb-forprint:MA05-1: PIN HEADER; OC_FARNELL: unknown; OC_NEWARK: unknown
M-SW = switch:TL36PO: TINY SWITCH ON - ON Source: http://www2.produktinfo.conrad.com/datenblaetter/700000-724999/705152-da-01-de-Subminiaturschalter_TL_36YO.pdf
MAIN-SPL VOLTAGE-METER1 VOLTAGE-METER2 = forprint:XH-2: low insertion CON
MAINSW2 = 0con-lstb:MA03-1: PIN HEADER; OC_FARNELL: unknown; OC_NEWARK: unknown
MEGA1 MEGA2 = atmel:MEGA8: MICROCONTROLLER 8 Kbytes FLASH, 1 kbytes SRAM, 512 bytes EEPROM, USART, 6-channel 10 bit ADC, 2-channel 8 bit ADC Pin compatible with Atmega48, ATMega88, ATMega168 Source: avr.lbr; MPN: ATMEGA8-16AU; OC_FARNELL: 9171371; OC_NEWARK: 73M8863
MEGA1-C1 MEGA2-C1 XMEGA-C1 XMEGA-C2 = rcl:C-EU: CAPACITOR, European symbol
MOTORDRIVER = 0con-harting-ml:ML14: HARTING; OC_FARNELL: unknown; OC_NEWARK: unknown
Q1 Q2 = 0Murata-ceralocks-forprint:CSTLS_X: Ceramic resonator 16.00 to 70.00 MHz
Q3-Q5 = transistor-power:IRF9530: P-CHANNEL HEXFET POWER-MOS-FET Source: http://www.irf.com/product-info/datasheets/data/irf9530.pdf
R1 R2 = resistor:R-EU_: RESISTOR, European symbol
RESET-MEGA1 RESET-MEGA2 RESET-XMEGA XMEGA-TEST1-XMEGA-TEST3 = forprint:DTS-6
S1 = switch-dil-forprint:DIP08S: DIL/CODE SWITCH; OC_FARNELL: unknown; OC_NEWARK: unknown
S2 = switch:M251: SLIDING SWITCH Mors, distributor Buerklin, 11G702
SG1 = buzzer:F/EE17P: BUZZER Source: Buerklin; OC_FARNELL: unknown; OC_NEWARK: unknown
SP-RC1 SP-RC2 = resistor:R-TRIMM: Trimm resistor
SP-SW2 = switch-dil:219-02*: Surface Mount DIP Switch Series 219 SMT CTS Electronic Components Sourc: www.ctscorp.com; OC_FARNELL: unknown; OC_NEWARK: unknown
SPI-R = 0@Mylibrary-main1:XH-6: low insertion connector 6
SPI-SW = switch-dil:DIP03YL: DIL/CODE SWITCH
SUOPPLY-SW2 TOUCH1 TOUCH2 = forprint:XH-3: low insertion CON
SUPPLY3.3V SUPPLY5V SUPPLY9 = con-ptr500:AK500/2: CONNECTOR; OC_FARNELL: unknown; OC_NEWARK: unknown
SV1 = con-harting-ml:ML6: HARTING; OC_FARNELL: unknown; OC_NEWARK: unknown
TO-UNDER = 0con-harting-ml:ML26: HARTING; OC_FARNELL: unknown; OC_NEWARK: unknown
TW-SP = 0@Mylibrary-main1:XH-2: low insertion CON
U1 = atmel-xmega:ATXMEGA128A1U: 8/16-bit XMEGA A1U Microcontroller Features High-performance, low-power Atmel® AVR® XMEGA® 8/16-bit Microcontroller Nonvolatileprogram and data memories – 64K - 128KBytes of in-system self-programmable flash – 4K - 8KBytes boot section – 2KBytes EEPROM – 4K - 8KBytes internal SRAM External bus interface for up to 16Mbytes SRAM External bus interface for up to 128Mbit SDRAM Peripheral features – Four-channel DMA controller – Eight-channel event system – Eight 16-bit timer/counters Four timer/counters with 4 output compare or input capture channels Four timer/counters with 2 output compare or input capture channels High resolution extension on all timer/counters Advanced waveform extension (AWeX) on two timer/counters – One USB device interface USB 2.0 full speed (12Mbps) and low speed (1.5Mbps) device compliant 32 Endpoints with full configuration flexibility – Eight USARTs with IrDA support for one USART – Four two-wire interfaces with dual address match (I2C and SMBus compatible) – Four serial peripheral interfaces (SPIs) – AES and DES crypto engine – CRC-16 (CRC-CCITT) and CRC-32 (IEEE® 802.3) generator – 16-bit real time counter (RTC) with separate oscillator – Two sixteen channel, 12-bit, 2msps Analog to Digital Converters – Two Two-channel, 12-bit, 1msps Digital to Analog Converters – Four Analog Comparators (ACs) with window compare function, and current sources – External interrupts on all general purpose I/O pins – Programmable watchdog timer with separate on-chip ultra low power oscillator – QTouch® library support Capacitive touch buttons, sliders and wheels Special microcontroller features – Power-on reset and programmable brown-out detection – Internal and external clock options with PLL and prescaler – Programmable multilevel interrupt controller – Five sleep modes – Programming and debug interfaces JTAG (IEEE 1149.1 compliant) interface, including boundary scan PDI (Program and Debug Interface) I/O and packages – 78 Programmable I/O pins – 100 lead TQFP – 100 ball BGA – 100 ball VFBGA Operating voltage – 1.6 – 3.6V Operating frequency – 0 – 12MHz from 1.6V – 0 – 32MHz from 2.7V
U2 = 23K256-I_SN:23K256-I/SN: None; AVAILABILITY: Good; DESCRIPTION: 23K256 Series 2.7 V to 3.6 V 256 kbit SPI Bus Low-Power Serial SRAM - SOIC-8; MF: Microchip; MP: 23K256-I/SN; PACKAGE: SOIC-8 Microchip; PRICE: 1.24 USD
U$2 = con-molex:5566-04A
X2 = kamiki-dcjack:DCJACK: DC JACK 2.1mmφ - 5.5mmφ DCジャック、基板用。

## Board
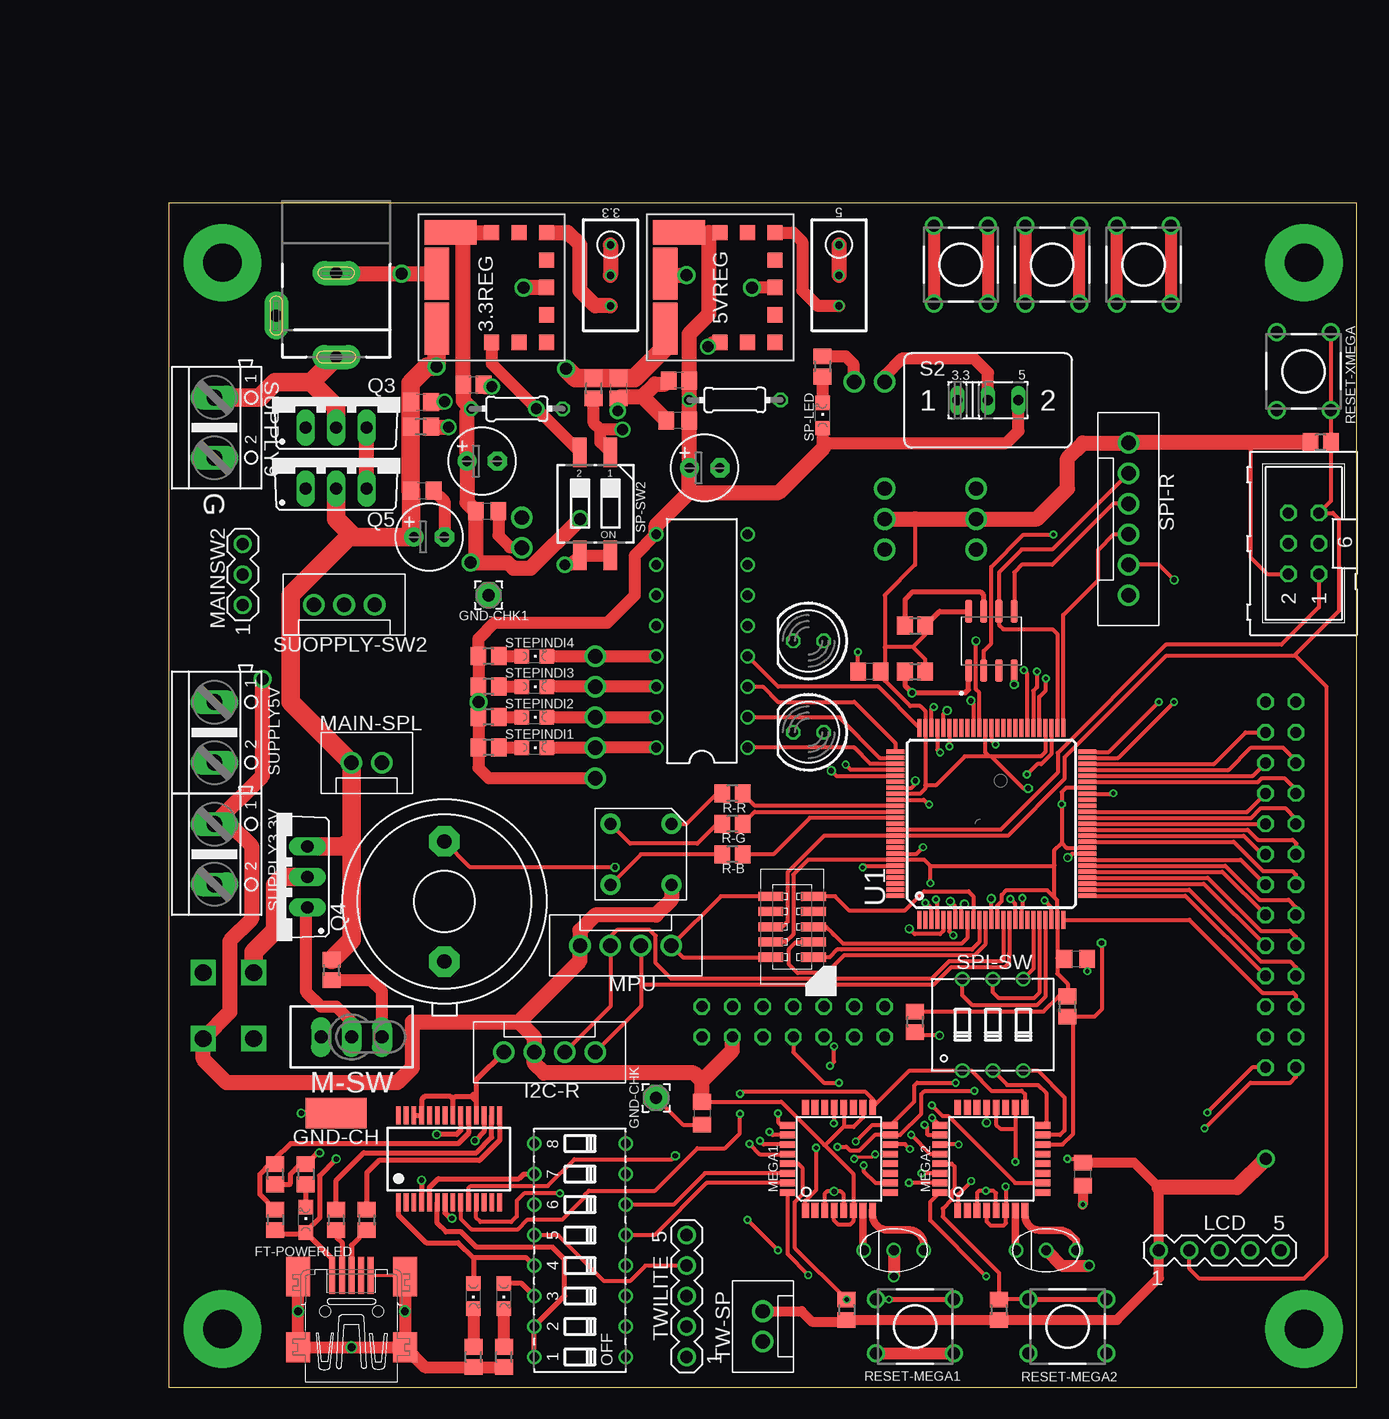
[diagram p6: board, top side]
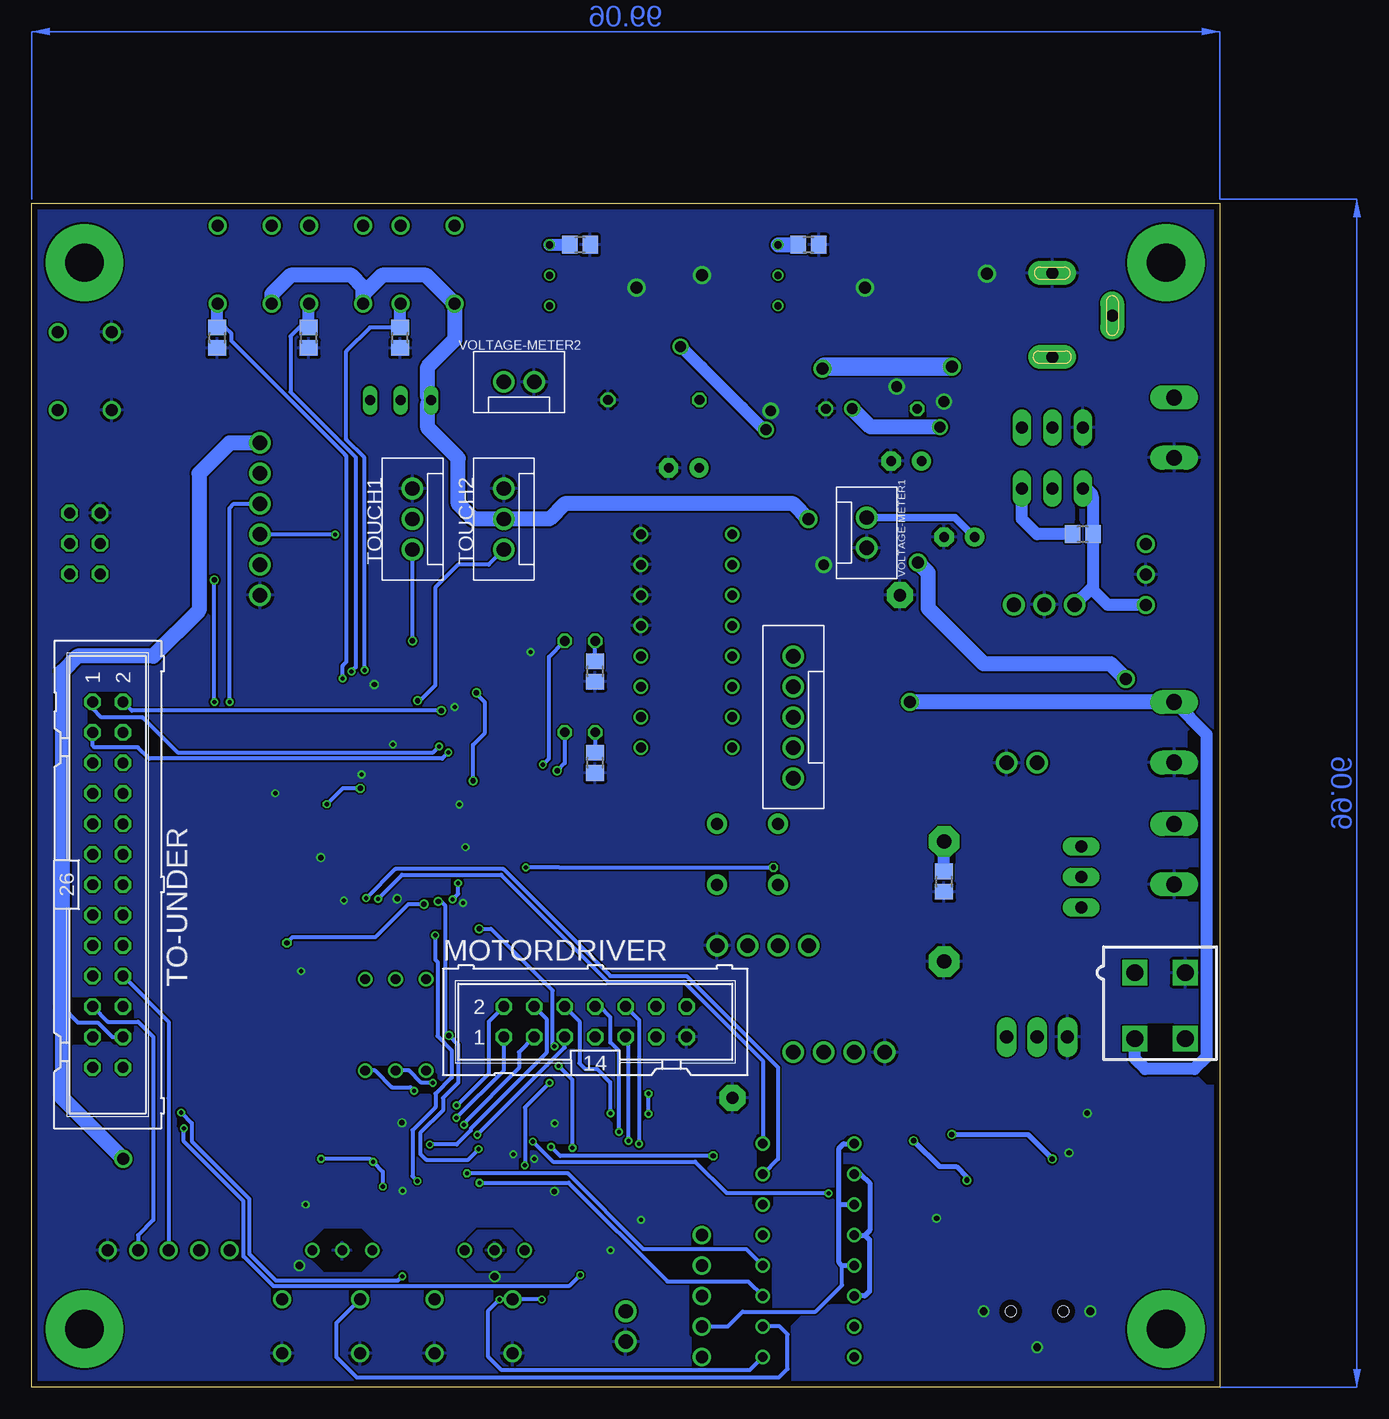
[diagram p7: board, bottom side, seen from below]

Size 99.04 x 98.73 mm. Coordinates in mm from the lower left corner, seen from the top.
Outline: 0,0 99.04,0 99.04,98.73 0,98.73 0,0
Copper layers (1*16): Top 0.035mm / dielectric 1.6mm / Bottom 0.035mm
Design rules "Elecrow_2-layer_PCB_eagle_rule": minimum track width 6mil, minimum drill 12mil, track to track 6mil, track to pad 6mil, pad to pad 6mil, via to via 8mil, smd to smd 0mil, copper to edge 20mil, drill to drill 10mil, minimum pad ring 6mil, minimum via ring 6mil, stop-mask expansion 0mil, vias tented up to drill 100mil, thermal gap 10mil
bRestrict: area 29.9,9.5 to 31.4,17.8; 217 lines

### Footprints (pad centres in the part's own frame; a part is rotated, then mirrored left to right if it is on the bottom)
E2,5-6 = drill 0.813 pad 1.6: + -1.27,0 | drill 0.813 pad 1.6 octagon: - 1.27,0
C0805 = smd 1.3 x 1.5: 1 -0.95,0; 2 0.95,0
OKL-T/3-W5 = smd 1.27 x 1.27: 1 -10.67,6.1; 5 -1.52,6.1; 6 -1.52,1.52; 7 -6.09,1.52; 8 -8.38,1.52; 9 -10.67,1.52; 10 -10.67,3.81; 11 -1.52,3.81; 12 -3.81,1.52 | smd 4.32 x 2.03: 2 -9.53,10.67; 3 -4.95,10.67 | smd 2.03 x 4.32: 4 -1.52,9.53
C2012 = smd 1.3 x 1.5: 1 -0.85,0; 2 0.85,0
OSTA71A1D-A = drill 1 pad 1.676: ANODE 2.54,2.54; BLUE 2.54,-2.54; GREEN -2.54,-2.54; RED -2.54,2.54
R0805 = smd 1.3 x 1.5: 1 -0.85,0; 2 0.85,0
32005-201 = smd 3.1 x 0.5: 1 3,1.6; 2 3,0.8; 3 3,0; 4 3,-0.8; 5 3,-1.6 | smd 2.5 x 2: M1 -3,-4.45; M2 -3,4.45 | smd 3.3 x 2: M3 2.9,4.45; M4 2.9,-4.45 | hole 0.9: 0,2.2; 0,-2.2
CHIPLED_0805 = smd 1.2 x 1.2: A 0,-1.05; C 0,1.05
SMD2,54-5,08 = smd 2.54 x 5.08: 1 0,0
2,15/1,0 = drill 1.016 pad 2.159 octagon: 1 0,0
CON4 = drill 1.2: P$1 -3.81,0; P$2 -1.27,0; P$3 1.27,0; P$4 3.81,0
SSOP28 = smd 0.4 x 1.5: 1 -4.225,-3.625; 2 -3.575,-3.625; 3 -2.925,-3.625; 4 -2.275,-3.625; 5 -1.625,-3.625; 6 -0.975,-3.625; 7 -0.325,-3.625; 8 0.325,-3.625; 9 0.975,-3.625; 10 1.625,-3.625; 11 2.275,-3.625; 12 2.925,-3.625; 13 3.575,-3.625; 14 4.225,-3.625; 15 4.225,3.625; 16 3.575,3.625; 17 2.925,3.625; 18 2.275,3.625; 19 1.625,3.625; 20 0.975,3.625; 21 0.325,3.625; 22 -0.325,3.625; 23 -0.975,3.625; 24 -1.625,3.625; 25 -2.275,3.625; 26 -2.925,3.625; 27 -3.575,3.625; 28 -4.225,3.625
DIL16 = drill 0.813: 1 -8.89,-3.81; 2 -6.35,-3.81; 3 -3.81,-3.81; 4 -1.27,-3.81; 5 1.27,-3.81; 6 3.81,-3.81; 7 6.35,-3.81; 8 8.89,-3.81; 9 8.89,3.81; 10 6.35,3.81; 11 3.81,3.81; 12 1.27,3.81; 13 -1.27,3.81; 14 -3.81,3.81; 15 -6.35,3.81; 16 -8.89,3.81
CON5 = drill 1.2: P$1 -5.08,0; P$2 -2.54,0; P$3 0,0; P$4 2.54,0; P$5 5.08,0
20021221-00010C4LF = smd 0.76 x 2.05: 1 -2.54,-1.78; 2 -2.54,1.78; 3 -1.27,-1.78; 4 -1.27,1.78; 5 0,-1.78; 6 0,1.78; 7 1.27,-1.78; 8 1.27,1.78; 9 2.54,-1.78; 10 2.54,1.78
LED5MM = drill 0.813 octagon: A -1.27,0; K 1.27,0
MA05-1 = drill 1.016: 1 -5.08,0; 2 -2.54,0; 3 0,0; 4 2.54,0; 5 5.08,0
TL3XPO = drill 1.1 pad 1.422 long: 1 -2.54,0; 2 0,0; 3 2.54,0
CON2 = drill 1.2: P$1 -1.27,0; P$2 1.27,0
MA03-1 = drill 1.016: 1 -2.54,0; 2 0,0; 3 2.54,0
TQFP32-08 = smd 1.27 x 0.559: 1 -4.293,2.8; 2 -4.293,2; 3 -4.293,1.2; 4 -4.293,0.4; 5 -4.293,-0.4; 6 -4.293,-1.2; 7 -4.293,-2; 8 -4.293,-2.8; 17 4.293,-2.8; 18 4.293,-2; 19 4.293,-1.2; 20 4.293,-0.4; 21 4.293,0.4; 22 4.293,1.2; 23 4.293,2; 24 4.293,2.8 | smd 0.559 x 1.27: 9 -2.8,-4.293; 10 -2,-4.293; 11 -1.2,-4.293; 12 -0.4,-4.293; 13 0.4,-4.293; 14 1.2,-4.293; 15 2,-4.293; 16 2.8,-4.293; 25 2.8,4.293; 26 2,4.293; 27 1.2,4.293; 28 0.4,4.293; 29 -0.4,4.293; 30 -1.2,4.293; 31 -2,4.293; 32 -2.8,4.293
ML14 = drill 0.914 octagon: 1 -7.62,-1.27; 2 -7.62,1.27; 3 -5.08,-1.27; 4 -5.08,1.27; 5 -2.54,-1.27; 6 -2.54,1.27; 7 0,-1.27; 8 0,1.27; 9 2.54,-1.27; 10 2.54,1.27; 11 5.08,-1.27; 12 5.08,1.27; 13 7.62,-1.27; 14 7.62,1.27
CSTLS_X = drill 0.813: 1 -2.5,0; 2 0,0; 3 2.5,0
TO220BV = drill 1.016 long: D 0,-2.54; G -2.54,-2.54; S 2.54,-2.54
0204/7 = drill 0.813 octagon: 1 -3.81,0; 2 3.81,0
DTS-6 = drill 1: 1 -3.25,2.25; 2 3.25,2.25; 3 -3.25,-2.25; 4 3.25,-2.25
DIP08S = drill 0.813: 1 -8.89,-3.81; 2 -6.35,-3.81; 3 -3.81,-3.81; 4 -1.27,-3.81; 5 1.27,-3.81; 6 3.81,-3.81; 7 6.35,-3.81; 8 8.89,-3.81; 9 8.89,3.81; 10 6.35,3.81; 11 3.81,3.81; 12 1.27,3.81; 13 -1.27,3.81; 14 -3.81,3.81; 15 -6.35,3.81; 16 -8.89,3.81
M251 = drill 0.813 long: 1 -2.54,0; 2 0,0; 3 2.54,0
F/EE17P = drill 1.194 pad 2.54 octagon: 1 -5.004,0; 2 5.004,0
RTRIM3296W = drill 0.61: 1 0,-2.54; 2 0,0; 3 0,2.54
CTS-219-02 = smd 1.13 x 2.44: 1 -1.27,-4.3; 2 1.27,-4.3; 3 1.27,4.3; 4 -1.27,4.3
CON6 = drill 1.2: P$1 -6.35,0; P$2 -3.81,0; P$3 -1.27,0; P$4 1.27,0; P$5 3.81,0; P$6 6.35,0
DIP03YL = drill 0.813: 1 -2.54,-3.81; 2 0,-3.81; 3 2.54,-3.81; 4 2.54,3.81; 5 0,3.81; 6 -2.54,3.81
CON3 = drill 1.2: P$1 -2.54,0; P$2 0,0; P$3 2.54,0
AK500/2 = drill 1.321 long: 1 -2.515,0; 2 2.515,0
ML6 = drill 0.914 octagon: 1 -2.54,-1.27; 2 -2.54,1.27; 3 0,-1.27; 4 0,1.27; 5 2.54,-1.27; 6 2.54,1.27
ML26 = drill 0.914 octagon: 1 -15.24,-1.27; 2 -15.24,1.27; 3 -12.7,-1.27; 4 -12.7,1.27; 5 -10.16,-1.27; 6 -10.16,1.27; 7 -7.62,-1.27; 8 -7.62,1.27; 9 -5.08,-1.27; 10 -5.08,1.27; 11 -2.54,-1.27; 12 -2.54,1.27; 13 0,-1.27; 14 0,1.27; 15 2.54,-1.27; 16 2.54,1.27; 17 5.08,-1.27; 18 5.08,1.27; 19 7.62,-1.27; 20 7.62,1.27; 21 10.16,-1.27; 22 10.16,1.27; 23 12.7,-1.27; 24 12.7,1.27; 25 15.24,-1.27; 26 15.24,1.27
TQFP-100A-100 = smd 1.5 x 0.35: 1 -8,6; 2 -8,5.5; 3 -8,5; 4 -8,4.5; 5 -8,4; 6 -8,3.5; 7 -8,3; 8 -8,2.5; 9 -8,2; 10 -8,1.5; 11 -8,1; 12 -8,0.5; 13 -8,0; 14 -8,-0.5; 15 -8,-1; 16 -8,-1.5; 17 -8,-2; 18 -8,-2.5; 19 -8,-3; 20 -8,-3.5; 21 -8,-4; 22 -8,-4.5; 23 -8,-5; 24 -8,-5.5; 25 -8,-6; 51 8,-6; 52 8,-5.5; 53 8,-5; 54 8,-4.5; 55 8,-4; 56 8,-3.5; 57 8,-3; 58 8,-2.5; 59 8,-2; 60 8,-1.5; 61 8,-1; 62 8,-0.5; 63 8,0; 64 8,0.5; 65 8,1; 66 8,1.5; 67 8,2; 68 8,2.5; 69 8,3; 70 8,3.5; 71 8,4; 72 8,4.5; 73 8,5; 74 8,5.5; 75 8,6 | smd 0.35 x 1.5: 26 -6,-8; 27 -5.5,-8; 28 -5,-8; 29 -4.5,-8; 30 -4,-8; 31 -3.5,-8; 32 -3,-8; 33 -2.5,-8; 34 -2,-8; 35 -1.5,-8; 36 -1,-8; 37 -0.5,-8; 38 0,-8; 39 0.5,-8; 40 1,-8; 41 1.5,-8; 42 2,-8; 43 2.5,-8; 44 3,-8; 45 3.5,-8; 46 4,-8; 47 4.5,-8; 48 5,-8; 49 5.5,-8; 50 6,-8; 76 6,8; 77 5.5,8; 78 5,8; 79 4.5,8; 80 4,8; 81 3.5,8; 82 3,8; 83 2.5,8; 84 2,8; 85 1.5,8; 86 1,8; 87 0.5,8; 88 0,8; 89 -0.5,8; 90 -1,8; 91 -1.5,8; 92 -2,8; 93 -2.5,8; 94 -3,8; 95 -3.5,8; 96 -4,8; 97 -4.5,8; 98 -5,8; 99 -5.5,8; 100 -6,8
SOIC127P600X175-8N = smd 1.91 x 0.6: 1 -2.46,1.905; 2 -2.46,0.635; 3 -2.46,-0.635; 4 -2.46,-1.905; 5 2.46,-1.905; 6 2.46,-0.635; 7 2.46,0.635; 8 2.46,1.905
5566-04A = drill 1.4 square: 1 2.1,-2.75; 2 -2.1,-2.75; 3 2.1,2.75; 4 -2.1,2.75
MJ-179P = drill 1 pad 2 long: 1 3,0; 2 -4,0; 3 -0.45,-5

### Placement (x,y rotation side)
3.3C1  26.14,77.22 0 top
3.3C2  26.54,73.05 0 top
3.3REG  33.02,97.79 90 top
5C1  44.68,76.66 0 top
5C2  42.44,80.59 180 top
5VREG  52.07,97.79 90 top
9C1  21.72,70.89 0 top
9C2  21.13,74.78 0 top
C1  37.49,83.29 270 top
C2  42.55,83.95 180 top
C3  21.03,82.14 0 top
C4  25.4,83.59 0 top
CHECKLED  39.37,44.45 270 top
ERROR1-R  52.07,59.69 90 bottom
ERROR2-R  52.07,52.07 90 bottom
FT232-R8  25.4,2.54 90 top
FT232-R9  27.94,2.54 90 top
FT232-R10  8.89,13.97 270 top
FT232-R11  8.89,17.78 90 top
FT232-R12  11.43,17.78 270 top
FT232-R13  16.51,13.97 270 top
FT232-R14  13.97,13.97 270 top
FT232USBCON  15.24,6.35 90 top
FT-POWERLED  11.43,13.97 0 top
GND-CH  13.97,22.86 90 top
GND-CHK  40.64,24.13 0 top
GND-CHK1  26.67,66.04 0 top
I2C-R  31.75,27.94 180 top
IC1  23.37,19.05 0 top
IC2  44.45,62.23 90 top
INDILED1  26.67,53.34 180 top
INDILED2  26.67,55.88 180 top
INDILED3  26.67,58.42 180 top
INDILED4  26.67,60.96 180 top
J1  35.56,55.88 90 bottom
JTAG  51.97,38.4 90 top
L3  53.34,62.23 180 top
L4  53.34,54.61 180 top
L5  27.94,7.62 180 top
L6  25.4,7.62 180 top
LCD  87.63,11.43 0 top
M1-R1  56.52,6.48 270 top
M2-R1  69.22,6.48 270 top
M-SW  15.24,29.21 180 top
MAIN-SPL  16.51,52.07 0 top
MAINSW2  6.17,67.77 90 top
MEGA1  55.88,19.05 90 top
MEGA1-C1  44.45,22.86 270 top
MEGA2  68.58,19.05 90 top
MEGA2-C1  76.2,17.78 90 top
MOTORDRIVER  52.07,30.48 0 bottom
MPU  38.1,36.83 180 top
Q1  60.45,11.43 0 top
Q2  73.15,11.43 0 top
Q3  13.97,82.55 0 top
Q4  9.02,42.54 90 top
Q5  13.97,77.47 0 top
R1  47.19,82.32 0 top
R2  29.03,81.58 0 top
R-B  46.99,44.45 180 top
R-G  46.99,46.99 180 top
R-R  46.99,49.53 180 top
RESET-MEGA1  62.23,5.08 0 top
RESET-MEGA2  74.93,5.08 0 top
RESET-XMEGA  94.61,84.71 270 top
S1  34.29,11.43 90 top
S2  68.3,82.3 0 top
SG1  22.99,40.51 270 top
SL-R1  54.51,85.12 270 top
SP-LED  54.51,81.03 0 top
SP-R1  53.34,95.25 180 bottom
SP-R2  35.43,83.29 90 top
SP-R3  34.29,95.25 180 bottom
SP-R4  21.03,80.09 180 top
SP-R5  13.59,34.8 90 top
SP-R6  11.43,71.12 180 bottom
SP-RC1  55.88,92.71 180 top
SP-RC2  36.83,92.71 180 top
SP-SW2  35.56,73.66 180 top
SPI-R  80.01,72.39 270 top
SPI-SW  68.71,30.23 0 top
SRAM-R1  62.23,59.69 0 top
SRAM-R2  62.23,63.5 0 top
SS-R1  62.23,30.48 90 top
SS-R2  74.93,31.75 90 top
STEPINDI1  30.48,53.34 270 top
STEPINDI2  30.48,55.88 270 top
STEPINDI3  30.48,58.42 270 top
STEPINDI4  30.48,60.96 270 top
SUOPPLY-SW2  14.63,65.25 0 top
SUPPLY3.3V  3.81,44.45 270 top
SUPPLY5V  3.81,54.61 270 top
SUPPLY9  3.81,80.01 270 top
SV1  94.61,70.36 90 top
TESTSW-R1  83.57,87.5 90 bottom
TESTSW-R2  75.95,87.5 90 bottom
TESTSW-R3  68.33,87.5 90 bottom
TO-UNDER  92.71,41.91 270 bottom
TOUCH1  67.31,72.39 90 bottom
TOUCH2  59.69,72.39 90 bottom
TW-SP  49.53,5.08 90 top
TWILITE  43.18,7.62 90 top
U1  68.58,46.99 90 top
U2  68.58,62.23 90 top
U$2  4.98,31.83 180 bottom
VOLTAGE-METER1  29.44,71.25 270 bottom
VOLTAGE-METER2  58.42,83.82 0 bottom
X2  13.97,88.9 270 top
X-R1  96.04,78.79 180 top
X-R2  22.99,42.16 90 bottom
XMEGA-C1  75.62,35.74 0 top
XMEGA-C2  58.42,59.69 180 top
XMEGA-TEST1  81.28,93.6 90 top
XMEGA-TEST2  73.66,93.6 90 top
XMEGA-TEST3  66.04,93.6 90 top

### Tracks (layer width: path | path; a pad name or v marks a point on that pad's centre or on a via)
+3V3  (via drill 0.35, 0.45, 1)
  Top 0.152: XMEGA-C1.1 74.13,35.74 74.08,35.79
  Top 0.33: 63.08,50.19 U1.74 63.08,56.38 62.66,56.79 61.82,56.79 59.69,58.93 59.69,59.69 | 63.08,50.19 63.08,49.95 62.62,49.49 U1.83 | U1.14 69.08,40.17 69.44,40.54 69.44,41.07 69.83,41.45 73.23,41.45 73.85,40.83 | 73.85,40.83 74.08,40.6 U1.24 74.08,35.79 74.08,34.5 74.95,33.63 74.95,32.68 74.88,32.6 | U1.44 74.81,49.99 74.45,49.63 v74.45,48.62 74.45,45.39 | U1.34 74.85,44.99 74.45,45.39 | U1.54 73.08,52.99 72.69,52.6 68.58,52.6 | 68.58,52.6 68.43,52.6 | U1.64 68.08,52.95 68.43,52.6 | 62.23,72.39 62.23,68.58 59.69,66.04 59.69,61.72 | MEGA1.4 55.48,13.91 55.83,13.56 56.79,13.56 57.08,13.85 MEGA1.6 57.08,17.8 54.66,20.22 | MEGA1-C1.1 51.07,23.81 54.66,20.22 | MEGA2.4 68.18,13.84 68.5,13.51 69.62,13.51 69.8,13.69 69.8,14.74 MEGA2.6 v69.77,16.74 | MEGA2.18 70.58,21.49 | 70.58,21.49 v70.58,18.8 v70.59,18.8 | v74.93,19.05 75.88,19.05 MEGA2-C1.2 | SS-R1.2 72.94,31.33 74.2,32.6 74.88,32.6 | 74.88,32.6 SS-R2.2 | 68.43,52.6 66.37,52.6 63.96,50.19 63.08,50.19 | 73.85,40.83 73.85,43.54 | 73.85,43.54 73.85,44.79 74.45,45.39 | 68.58,52.6 71.25,49.94 v71.65,49.94 | 59.69,59.69 XMEGA-C2.1 | MEGA1.18 57.88,22.5 57.1,21.72 56.24,21.72 | 56.24,21.72 54.74,20.22 54.66,20.22 | U1.4 64.08,40.57 v63.96,40.69 | v63.5,42.04 63.5,43.48 | 63.5,43.48 62.99,43.99 U1.94 53.31,43.99 52.07,42.75 52.07,37.77 51.44,37.13 JTAG.4 | MEGA1.20 56.28,21.76 56.24,21.72 | MEGA2.20 68.98,21.9 69.32,21.57 70.5,21.57 70.58,21.49 | 59.69,61.72 59.69,59.69 | SRAM-R1.2 63.08,60.69 62.05,61.72 | 62.05,61.72 59.69,61.72 | SRAM-R2.2 63.08,62.75 62.05,61.72 | 63.5,43.48 73.8,43.48 73.85,43.54 | 90.17,78.79 90.17,69.22 91.57,67.82 SV1.2
  Top 0.406: SRAM-R2.2 64.27,64.69 U2.8
  Top 0.813: TW-SP.P$2 52.76,6.35 53.62,5.49 56.37,5.49 M1-R1.2 M2-R1.2 79.06,5.63 82.55,9.12 LCD.1 82.55,16.66 80.48,18.73 MEGA2-C1.2
  Top 1.016: XMEGA-TEST3.2 XMEGA-TEST3.1 | XMEGA-TEST2.2 XMEGA-TEST2.1 | XMEGA-TEST1.1 XMEGA-TEST1.2
  Top 1.27: 29.21,30.48 20.32,30.48 20.32,26.67 19.05,25.4 4.83,25.4 2.88,27.35 U$2.4 5.11,31.3 5.11,37.21 6.91,39.01 6.91,45.16 5.11,46.96 SUPPLY3.3V.1 7.82,50.98 v7.82,59.05 | 29.21,30.48 30.48,29.21 I2C-R.P$3 30.48,27.03 31.29,26.21 43.79,26.21 44.45,25.55 | 29.21,30.48 34.29,35.56 MPU.P$4 34.29,38.1 35.56,39.37 40.64,39.37 41.91,40.64 CHECKLED.ANODE | TOUCH2.P$2 62.23,72.39 TOUCH1.P$2 72.39,72.39 74.93,74.93 74.93,77.47 76.2,78.74 SPI-R.P$1 80.06,78.79 90.17,78.79 X-R1.2 | MEGA1-C1.1 44.45,25.55 | 44.45,25.55 46.99,28.09 MOTORDRIVER.11 | 3.3REG.4 24.89,96.27 | 24.89,96.27 3.3REG.5 | v34.29,72.39 30.19,68.29 28.74,68.29 28.27,68.76 v25.17,68.76 25.59,69.18 3.3C2.1 24.87,73.78 3.3C1.+ 24.87,81.23 R2.1 24.55,82.26 C4.1 24.55,95.93 24.89,96.27 | v91.44,19.05 89.05,16.66 82.55,16.66
  Bottom 0.33: v69.77,16.74 69.77,17.98 v70.59,18.8 70.84,19.05 v74.93,19.05 | v71.65,49.94 73.13,49.94 v74.45,48.62 | v63.96,40.69 63.5,41.15 v63.5,42.04 | 96.52,31.75 95.2,30.43 93.55,30.43 92.33,29.21 TO-UNDER.24
  Bottom 1.27: XMEGA-TEST1.1 79.03,91.15 77.47,92.71 72.39,92.71 71.41,91.73 XMEGA-TEST2.1 71.41,91.15 69.85,92.71 66.15,92.71 XMEGA-TEST3.1 63.79,87.34 66.04,85.09 66.04,82.58 S2.1 66.04,82.02 66.04,80.01 63.5,77.47 63.5,73.66 62.23,72.39 TOUCH2.P$2 55.88,72.39 54.61,73.66 35.56,73.66 v34.29,72.39 | v7.82,59.05 9.09,60.32 19.68,60.32 24.31,64.95 24.31,67.89 v25.17,68.76 | SPI-R.P$1 82.55,78.74 85.09,76.2 85.09,64.77 88.9,60.96 95.25,60.96 96.52,59.69 96.52,31.75 96.52,24.13 v91.44,19.05
+5V  (via drill 1)
  Top 1.016: J1.P$1 26.67,50.8 25.82,51.65 INDILED1.2 INDILED2.2 v25.82,57.15 INDILED3.2 INDILED4.2 25.82,62.4 27.18,63.75 36.58,63.75 38.86,66.04 38.86,69.34 IC2.9 | SP-LED.A 54.51,78.46 54.61,78.36 54.99,78.74 69.85,78.74 70.84,79.73 S2.3
  Top 1.27: 5VREG.4 45.01,96.27 | 45.01,96.27 5VREG.5 | 45.01,96.27 45.01,89.43 43.38,87.81 43.38,83.96 C2.1 43.38,83.94 R1.1 43.38,80.6 5C2.1 43.39,76.67 | 43.39,76.67 5C1.+ | IC2.9 40.64,71.86 43.39,74.61 | 43.39,74.61 43.39,76.67 | 43.39,74.61 50.86,74.61 54.61,78.36
  Bottom 1.016: SUPPLY5V.1 1.12,54.43 1.12,27.53 2.11,26.54 6.22,26.54 7.08,27.4 U$2.3
  Bottom 1.27: SUPPLY5V.1 25.8,57.12 v25.82,57.15
+9V  (via drill 1)
  Top 1.524: 3.3REG.2 v22.35,85.09 21.54,85.09 20.18,83.73 C3.1 SP-R4.2 9C2.1 20.19,74.77 20.19,74.12 20.19,71.15 9C1.+ 15.47,70.89 | SP-R5.2 15.24,37.3 15.24,45.72 | 15.24,45.72 15.24,48.77 MAIN-SPL.P$1 10.16,57.15 10.16,66.04 15.01,70.89 15.47,70.89 | Q5.D 13.97,72.39 15.47,70.89 | v33.15,84.91 33.92,84.14 SP-R2.2 C1.1 38.82,84.14 41.4,86.71 5VREG.2 | Q4.S 14.61,45.08 15.24,45.72
  Bottom 0.61: 9C1.+ 22.07,72.52 VOLTAGE-METER1.P$1
  Bottom 1.524: v22.35,85.09 32.97,85.09 v33.15,84.91
CK
  Top 0.33: U1.46 90.36,50.99 TO-UNDER.6
CS  (via drill 0.45)
  Top 0.33: U1.82 61.93,49.99 62.26,50.32 v62.26,50.57
  Top 0.406: SRAM-R1.1 61.38,58.51 v61.98,57.91 66.42,57.91 66.67,58.17 U2.1
  Bottom 0.33: v62.26,50.57 62.26,53.57 61.27,54.56 61.27,57.1 61.98,57.81 v61.98,57.91
DOUT
  Top 0.33: U1.48 87.17,51.99 89.79,54.61 TO-UNDER.4
FT232-RXD
  Top 0.33: TWILITE.4 39.75,10.16 38.46,8.87 36.3,8.87 32.46,12.7 S1.12
  Top 0.406: S1.14 29.43,8.67 L5.A | S1.10 29.59,17.78 29.21,17.4 22.48,17.4 21.74,16.66 IC1.5
  Bottom 0.406: 29.59,12.7 29.21,12.32 29.21,8 29.59,7.62 S1.14 | S1.12 29.59,12.7 | S1.10 29.92,17.78 29.18,17.04 29.18,13.11 29.59,12.7
FT232-TXD
  Top 0.406: IC1.1 19.14,14.38 21.46,12.07 24.13,12.07 25.4,10.79 | 25.4,10.79 L6.A | S1.13 29.84,10.79 25.4,10.79
  Bottom 0.33: TWILITE.2 41.02,5.08 39.78,6.32 33.71,6.32 31.5,8.53 31.5,10.16
  Bottom 0.406: S1.13 31.5,10.16 31.75,10.41 31.75,15.24 | S1.9 31.37,20.32 31.75,19.94 31.75,15.24 | S1.11 31.75,15.24
FT-POWERLED1
  Top 0.406: FT232-R12.2 FT-POWERLED.C
FT-RESET
  Top 0.406: S1.16 S1.15 33.02,7.62 33.02,10.67 32,11.68 25.65,11.68 24.38,12.95 23.11,12.95 22.39,13.68 IC1.6
GATE
  Top 0.33: U1.47 88.37,51.49 90.22,53.34 92.89,53.34 93.98,52.25 TO-UNDER.5
GND  (via drill 0.35, 0.45, 0.65, 0.9, 1)
  Top 0.152: XMEGA-C1.2 76.57,34.71 v76.58,34.7
  Top 0.254: FT232USBCON.5 19.59,9.35 FT232USBCON.M4 | v57.15,19.05 57.33,19.23 58.7,19.23 v58.9,19.43
  Top 0.33: U1.84 62.96,48.99 63.36,48.59 v63.4,48.59 | U1.13 v68.58,40.74 | U1.33 75.33,44.49 75.01,44.17 v74.95,44.17 | U1.63 68.58,53.95 v68.94,53.59 | MEGA2.5 68.98,16.19 68.78,16.38 v68.12,16.38 67.54,16.38 67.38,16.22 MEGA2.3 | MEGA2.21 v68.18,22.08 v68.17,22.07 | MEGA1.5 56.28,16.09 56.03,16.33 v55.47,16.33 54.89,16.33 54.68,16.12 MEGA1.3 | MEGA1.21 55.48,22.05 v55.45,22.02 | U1.53 73.58,52.8 72.75,51.97 72.42,51.97 v71.55,51.1 | GND-CHK.1 42.86,21.91 MEGA1-C1.2 | U2.4 v70.48,58.6 | U1.3 63.58,39.98 63.17,40.39 v63.09,40.39 | U1.93 62.35,44.49 v62.89,45.03 | U1.43 78.7,49.49 v78.74,49.53 | U1.73 63.58,56.52 v63.78,56.72 | U1.23 73.58,40.03 v73.03,40.59 | v48.26,13.97 v50.8,11.43 | XMEGA-C2.2 57.47,61.3 v57.45,61.32 | JTAG.10 46.02,40.95 MPU.P$1 42.88,35.86 JTAG.2
  Top 0.406: FT232-R11.1 10.07,16.93 10.16,17.02 10.16,17.78 11.01,18.63 FT232-R12.1 12.36,19.56 v12.57,19.56 | IC1.7 23.04,14.55 23.5,14.1 v23.62,14.1 | GND-CH.1 v11.05,22.86 | I2C-R.P$4 25.64,25.64 25.64,24.51 | 25.64,24.51 25.64,23.88 | 25.64,23.88 IC1.18 | IC1.26 IC1.25 21.09,24.01 21.34,24.26 23.5,24.26 23.69,24.06 | IC1.21 23.69,24.06 | 23.69,24.06 23.89,24.26 25.26,24.26 | 25.26,24.26 25.64,23.88 | 25.26,24.26 25.52,24.51 25.64,24.51
  Top 0.813: MEGA2-C1.1 v76.2,15.24
  Top 1.016: 5VREG.7 v48.65,91.7 v48.64,91.69 | SP-SW2.4 SP-SW2.3 33.51,68.58 v33.02,68.58 | FT232-R9.1 FT232-R8.1 21.35,1.69 FT232USBCON.M1 | FT232USBCON.M4 v19.69,6.35 FT232USBCON.M1 | FT232USBCON.M3 v10.79,6.35 FT232USBCON.M2 v15.24,3.35 FT232USBCON.M1 | RESET-MEGA1.3 RESET-MEGA1.4 | C1.2 37.49,81.46 v37.44,81.41 | 9C2.2 22.99,73.87 9C1.- | VOLTAGE-METER1.P$2 28.88,69.98 28.81,70.05 28.46,70.05 27.49,71.02 3.3C2.2 | SL-R1.1 56.43,85.97 57.07,85.32 57.07,83.9 VOLTAGE-METER2.P$2 | Q1.2 v60.45,9.25 | Q2.2 74.42,10.16 v76.73,10.16
  Top 1.27: X2.2 14.03,92.84 v19.43,92.84 3.3REG.3 | 5VREG.3 41.4,92.71 v43.18,92.71 | 3.3REG.7 v29.6,91.7 v29.59,91.69 | C2.2 41.4,83.65 40.53,83.65 39.47,82.59 | C1.2 37.64,82.59 39.47,82.59 | 5C2.2 39.5,82.59 39.47,82.59 | C4.2 26.42,83.43 v26.94,83.43 | C3.2 22.99,82.14 v23.01,82.17
  pour Bottom: -1.27,99.06 99.06,99.06 99.06,0 -1.27,0
HOLD
  Top 0.406: U2.7 67.94,66.04 67.69,66.29 61.98,66.29 61.38,65.7 SRAM-R2.1
M1CS  (via drill 0.35)
  Top 0.33: v50.8,22.86 50.8,22.1 51.05,21.85 MEGA1.25
  Bottom 0.33: MOTORDRIVER.6 53.39,30.53 53.39,27.03 52.91,26.54 51.92,26.54 50.83,25.45 50.83,22.89 v50.8,22.86
M1EN  (via drill 0.35)
  Top 0.33: v48.41,20.3 49.26,19.45 MEGA1.28
  Bottom 0.33: MOTORDRIVER.10 48.41,30.63 v48.41,20.3
M1INA  (via drill 0.35)
  Top 0.33: MEGA1.27 49.6,20.25 v49.3,20.55
  Bottom 0.33: v49.3,20.55 49.3,28.98 MOTORDRIVER.9
M1INB  (via drill 0.35)
  Top 0.33: MEGA1.26 50.35,21.05 v50.09,21.31
  Bottom 0.33: v50.09,21.31 50.09,28.04 50.8,28.75 50.8,30.86 51.69,31.75 MOTORDRIVER.8
M1PWM  (via drill 0.35)
  Top 0.33: MEGA1.10 58.92,17.05 57.94,18.03 v57.94,18.52 | MOTORDRIVER.7 52.07,27.94 54.61,25.4 v55.88,25.4
  Bottom 0.33: v55.88,25.4 57.94,23.34 v57.94,18.52
M2CS  (via drill 0.35)
  Top 0.33: MEGA2.25 63.51,22.63 v63.65,22.48
  Bottom 0.33: v63.65,22.48 59.69,26.44 MOTORDRIVER.1
M2EN  (via drill 0.35)
  Top 0.33: MEGA2.28 63.51,19.45 v61.9,21.06
  Bottom 0.33: v61.9,21.06 56.08,26.87 54.61,28.35 MOTORDRIVER.5
M2INA  (via drill 0.35)
  Top 0.33: v65.86,20.24 MEGA2.27
  Bottom 0.33: MOTORDRIVER.4 56.13,30.73 56.13,27.89 62.46,21.57 62.46,21.41 63.63,20.24 v65.86,20.24
M2INB  (via drill 0.35)
  Top 0.33: v63.02,21.89 63.22,21.69 63.22,21.13 63.3,21.05 MEGA2.26
  Bottom 0.33: MOTORDRIVER.3 58.42,27.94 58.42,26.62 63.02,22.02 v63.02,21.89
M2PWM  (via drill 0.35)
  Top 0.33: v63.63,23.52 64.52,22.63 65,22.63 70.58,17.05 MEGA2.10
  Bottom 0.33: MOTORDRIVER.2 60.96,30.48 60.96,26.14 63.58,23.52 v63.63,23.52
MISO-M  (via drill 0.35)
  Top 0.33: SPI-SW.2 69.9,25.22 72.47,25.22 73.15,24.54 73.15,22.13 MEGA2.16 | v65.61,25.4 62.38,25.4 62.15,25.17 62.15,23.83 MEGA1.16 58.63,21.85 v57.28,20.5 | v32.61,16.18 29.62,16.18 29.01,15.57 29.01,14.25 28.55,13.79 25.98,13.79 25.64,14.13 IC1.11
  Bottom 0.33: v65.61,25.4 66.57,25.4 67.59,26.42 SPI-SW.2 | v32.61,16.18 32.64,16.21 41.12,16.21 43.74,18.82 55.6,18.82 v57.28,20.5
MISO-X
  Top 0.33: U1.21 72.58,32.88 72.14,32.44 69.22,32.44 68.71,32.94 SPI-SW.5
MISOD
  Top 0.33: U1.31 88.08,43.49 90.93,40.64 93.37,40.64 93.98,40.03 TO-UNDER.15
MISOF  (via drill 0.35)
  Top 0.33: U1.51 74.58,64.4 77.5,67.31 77.5,69.83 78.79,71.12 SPI-R.P$4 | U2.2 67.94,61.39 68.58,62.03 68.58,68.4 71.27,71.09 v73.76,71.09
  Bottom 0.33: SPI-R.P$4 79.93,71.12 79.91,71.09 v73.76,71.09
MOSI-M  (via drill 0.35, 0.45)
  Top 0.33: SPI-SW.3 72.44,26.42 74.68,24.18 74.68,21.41 74.31,21.05 MEGA2.15 | IC1.10 24.99,16.61 25.17,16.79 31.6,16.79 33.83,19.03 41.96,19.03 v42.24,19.3 | v55.75,20.07 56.49,20.07 56.79,19.76 57.58,19.76 58.87,21.05 MEGA1.15 60.98,21.05 62.74,22.81 62.74,24.43 62.97,24.66 67.11,24.66 v67.16,24.71
  Bottom 0.33: SPI-SW.3 70.43,26.42 69.04,25.02 67.46,25.02 v67.16,24.71 | v42.24,19.3 54.99,19.3 v55.75,20.07
MOSI-X
  Top 0.33: U1.20 72.08,34.87 SPI-SW.4
MOSID
  Top 0.33: U1.30 87.82,42.99 TO-UNDER.16
MOSIF  (via drill 0.35)
  Top 0.33: SPI-R.P$3 78.74,73.66 73.66,68.58 71.12,68.58 70.48,67.95 U2.5 | U1.50 78.39,52.99 v82.55,57.15
  Bottom 0.33: SPI-R.P$3 82.19,73.66 82.55,73.3 v82.55,57.15
MV1
  Top 0.33: U1.27 85.08,41.49 91.06,35.51 93.5,35.51 93.98,35.03 TO-UNDER.19
MV2
  Top 0.33: U1.28 86.28,41.99 TO-UNDER.18
MV3
  Top 0.33: U1.29 86.62,42.49 91.03,38.07 93.47,38.07 93.98,37.57 TO-UNDER.17
MVS1  (via drill 0.35)
  Top 0.33: U1.70 v65.08,53.44
  Bottom 0.33: TO-UNDER.1 93.98,56.59 93.24,55.85 90.17,55.85 89.86,55.85 89.81,55.85 86.89,52.93 65.58,52.93 v65.08,53.44
MVS2  (via drill 0.45)
  Top 0.33: U1.71 64.58,56.12 64.87,56.41 v64.9,56.41
  Bottom 0.33: v64.9,56.41 90.7,56.41 TO-UNDER.2
MVS3  (via drill 0.35)
  Top 0.33: U1.72 64.08,53.14 64.29,52.93 v64.31,52.93
  Bottom 0.33: TO-UNDER.3 93.98,53.52 93.83,53.36 90.19,53.36 89.24,52.41 64.83,52.41 v64.31,52.93
N$1
  Top 0.33: U1.75 59.15,58.42 50.8,58.42 IC2.4
N$3
  Top 1.27: SP-RC1.1 SP-RC1.2
  Bottom 1.016: SP-RC1.1 SP-R1.2
N$4
  Top 0.33: IC2.3 49.53,58.42 50.8,57.15 57.15,57.15 60.58,53.72 U1.76
N$5
  Top 1.27: Q5.S Q3.S
  Bottom 1.016: SP-R6.2 15.24,71.12 16.51,72.39 Q5.S
N$6
  Top 1.524: Q4.D 9.53,42.54 8.89,41.91 8.89,38.1 7.08,36.29 U$2.1
N$7
  Top 1.27: SP-RC2.1 SP-RC2.2
  Bottom 1.27: SP-RC2.1 SP-R3.2
N$8
  Top 1.016: Q4.G 11.43,39.88 11.43,33.02 12.7,31.75 13.97,31.75 15.24,30.48 M-SW.2
N$9
  Top 1.016: 5VREG.6 52.07,96.27 52.83,95.5 52.83,91.44 54.1,90.17 SP-RC1.3
N$10
  Top 1.016: M-SW.1 17.78,33.02 16.85,33.95 SP-R5.1
N$11
  Top 1.016: S2.2 68.3,84.58 67.13,85.75 61.09,85.75 59.69,84.35 VOLTAGE-METER2.P$1
N$12
  Top 0.33: IC2.2 55.88,55.88 59.27,52.49 U1.77
N$13
  Top 1.27: 3.3REG.6 33.27,96.27 34.29,95.25 34.29,91.44 35.56,90.17 SP-RC2.3
N$14
  Top 0.33: U1.78 58.5,51.99 57.15,53.34 IC2.1
N$15  (via drill 0.9)
  Top 1.016: 3.3REG.1 26.92,85.33 v30.65,81.6 SP-SW2.2
  Top 1.27: SP-R4.1 21.91,80.06 v23.34,80.06
  Bottom 1.27: v23.34,80.06 29.11,80.06 v30.65,81.6
N$16
  Top 1.016: IC2.16 J1.P$2 STEPINDI1.C
N$17
  Top 1.016: STEPINDI2.C J1.P$3 IC2.15
N$18
  Top 1.016: IC2.14 J1.P$4 STEPINDI3.C
N$19
  Top 1.016: STEPINDI4.C J1.P$5 IC2.13
N$20
  Top 1.016: INDILED4.1 STEPINDI4.A
N$21
  Top 1.016: INDILED3.1 STEPINDI3.A
N$22
  Top 1.016: INDILED2.1 STEPINDI2.A
N$23
  Top 1.016: INDILED1.1 STEPINDI1.A
N$24
  Top 1.016: SL-R1.2 SP-LED.C
N$26  (via drill 0.9)
  Top 1.016: SP-SW2.1 35.99,78.8 35.99,79.83 | 35.99,79.83 35.43,80.39 SP-R2.1 | v44.96,86.77 45.31,87.12 5VREG.1 | v37.85,79.85 36.01,79.85 35.99,79.83
  Bottom 1.016: 39.83,81.69 43.2,85.06 44.91,86.77 v44.96,86.77 | 39.83,81.69 | 39.83,81.69 37.99,79.85 v37.85,79.85
N$27  (via drill 3.2 pad 6.45)
  other vias: 94.66,93.76
N$28  (via drill 3.2 pad 6.45)
  other vias: 4.49,93.76
N$29  (via drill 3.2 pad 6.45)
  other vias: 4.49,4.86
N$30  (via drill 3.2 pad 6.45)
  other vias: 94.66,4.86
N$31
  Top 0.61: MEGA2.7 70.58,11.5 Q2.1
N$33
  Top 0.61: MEGA2.8 71.38,14.38 arc90 72.65,13.11 74.28,13.11 arc-45 75.17,12.73 75.65,12.26 Q2.3
N$36
  Top 0.61: MEGA1.7 57.88,11.5 arc90 Q1.1
N$37
  Top 0.61: MEGA1.8 58.68,14.4 arc90 59.95,13.13 61.68,13.13 arc-90 62.95,11.86 Q1.3
N$38
  Top 1.524: SUPPLY9.1 7.59,82.53 8.89,83.82 11.89,83.82 | Q3.D 13.97,81.74 11.89,83.82 | X2.1 11.89,83.82
N$40
  Bottom 1.016: Q5.G arc90 10.58,74.08 SP-R6.1 10.58,66.76 10.73,66.61 | 10.73,66.61 SUOPPLY-SW2.P$1 | MAINSW2.1 9.35,65.23 10.73,66.61
N$42
  Top 1.016: FT232-R9.2 L5.C
N$43
  Top 1.016: L6.C FT232-R8.2
N$44
  Top 0.406: FT232-R14.2 13.97,12.57 14.44,12.1 FT232USBCON.2
N$45  (via drill 0.45)
  Top 0.406: 11.54,12.81 FT-POWERLED.A 11.43,12.95 12.57,14.1 12.57,17.65 v13.97,19.05 | 11.54,12.81 13.64,10.71 FT232USBCON.1 | FT232-R10.2 9.2,12.81 11.54,12.81 | IC1.20 24.34,21.42 24,21.08 v22.35,21.08
  Bottom 0.406: v22.35,21.08 16,21.08 v13.97,19.05
N$46
  Bottom 0.33: ERROR1-R.2 L3.K
N$47
  Bottom 0.33: L4.K ERROR2-R.2
N$48
  Top 0.406: FT232-R10.1 7.62,16.09 7.62,17.78 8.47,18.63 FT232-R11.2 8.89,19.05 10.16,20.32 24.13,20.32 24.99,21.18 IC1.19
N$49
  Top 0.406: FT232-R13.2 15.24,11.85 FT232USBCON.3
N$50
  Top 0.406: IC1.15 27.59,20.61 25.91,18.92 17.53,18.92 16.51,17.91 FT232-R13.1
N$51
  Top 0.406: FT232-R14.1 13.97,17.27 16.26,19.56 25.65,19.56 26.92,20.83 26.92,22.66 IC1.16
N$55  (via drill 0.45)
  Top 0.406: IC1.17 26.29,21.34 v25.53,20.57 | v21.08,17.27 IC1.4
  Bottom 0.406: v25.53,20.57 23.37,18.41 21.97,18.41 21.08,17.53 v21.08,17.27
N$56
  Top 0.33: CHECKLED.RED 43.18,46.99 45.72,49.53 R-R.2
N$57
  Top 0.33: R-G.2 45.72,46.99 44.07,45.34 38.48,45.34 CHECKLED.GREEN
N$58
  Top 0.33: R-B.2 39.37,44.45 CHECKLED.BLUE
N$64
  Top 0.33: SV1.1 95.89,65.05 92.76,61.92 83.13,61.92 74.12,52.91 74.12,51.26 69.35,46.49 U1.89
PA0  (via drill 0.35, 0.45)
  Top 0.33: v37.21,43.36 25.15,43.36 SG1.1 | v57.86,43.34 58.01,43.49 U1.95
  Bottom 0.33: v37.21,43.36 37.24,43.33 54.61,43.33 55.04,43.33 57.85,43.33 v57.86,43.34
  Bottom 1.016: X-R2.2 SG1.1
PH0  (via drill 0.35)
  Top 0.33: U1.55 72.58,57.57 73.13,58.11 v73.13,59.11
  Top 1.016: XMEGA-TEST1.4 XMEGA-TEST1.3
  Bottom 0.33: TESTSW-R1.2 82.92,88.35 82.4,87.83 82.4,87.22 72.92,77.75 72.8,77.62 72.8,60.5 73.13,60.17 v73.13,59.11
  Bottom 1.016: TESTSW-R1.2 83.57,90.31 XMEGA-TEST1.3
PH1  (via drill 0.35)
  Top 0.33: v72.39,59.69 72.39,58.37 72.08,58.06 U1.56
  Top 1.016: XMEGA-TEST2.3 XMEGA-TEST2.4
  Bottom 0.33: TESTSW-R2.2 76.75,88.35 77.47,87.63 77.47,82.98 72.03,77.55 72.03,60.05 v72.39,59.69
  Bottom 1.016: TESTSW-R2.2 75.95,90.31 XMEGA-TEST2.3
PH2  (via drill 0.35)
  Top 0.33: U1.57 71.58,59.51 v71.3,59.79
  Top 1.016: XMEGA-TEST3.4 XMEGA-TEST3.3
  Bottom 0.33: TESTSW-R3.2 70.85,88.35 72.82,86.39 72.82,79.02 71.3,77.5 v71.3,59.79
  Bottom 1.016: TESTSW-R3.2 68.33,90.31 XMEGA-TEST3.3
PING1
  Top 0.33: U1.35 88.77,45.49 91.21,43.05 93.65,43.05 93.98,42.72 TO-UNDER.13
PING2
  Top 0.33: U1.36 89.62,45.99 91.16,44.45 TO-UNDER.12
PING3
  Top 0.33: U1.37 89.96,46.49 90.81,45.64 93.7,45.64 94,45.34 93.98,45.31 TO-UNDER.11
PING4
  Top 0.33: U1.38 TO-UNDER.10
PING5
  Top 0.33: U1.39 90.26,47.49 91.06,48.28 93.07,48.28 93.98,47.37 TO-UNDER.9
PING6
  Top 0.33: U1.40 89.9,47.99 TO-UNDER.8
PJ0  (via drill 0.45)
  Top 0.33: U1.65 67.58,57.92 67.31,58.19 v67.31,62.23
  Bottom 0.33: v67.31,62.23 TOUCH1.P$1
PJ1  (via drill 0.45)
  Top 0.33: v66.88,57.25 67.08,57.05 U1.66
  Bottom 0.33: TOUCH2.P$1 60.96,68.58 63.5,68.58 65.41,66.67 65.41,58.52 66.65,57.28 66.85,57.28 v66.88,57.25
PK4  (via drill 0.35)
  Top 0.33: U1.79 56.87,51.49 v56.44,51.92
  Bottom 0.33: L3.A 55.93,60.91 55.93,52.7 55.93,52.6 55.93,52.43 v56.44,51.92
PK5  (via drill 0.45)
  Top 0.33: v55.24,51.41 55.66,50.99 U1.80
  Bottom 0.33: L4.A 54.61,52.04 v55.24,51.41
PQ0
  Top 0.33: U1.85 48.88,48.49 R-R.1
PQ1
  Top 0.33: R-G.1 48.84,47.99 U1.86
PQ2
  Top 0.33: U1.87 53.46,47.49 50.42,44.45 R-B.1
RANGE
  Top 0.33: U1.45 90.83,50.49 91.14,50.8 93.02,50.8 93.98,49.83 TO-UNDER.7
RESET-M1  (via drill 0.35)
  Top 0.33: MEGA1.29 52.49,18.65 52.83,18.31 52.83,16.1 52.17,15.44 52.17,11.66 56.5,7.33 M1-R1.1 | v60.06,7.33 RESET-MEGA1.1
  Top 0.406: RESET-MEGA1.1 v60.06,7.33 RESET-MEGA1.2
  Bottom 0.33: M1-R1.1 v60.06,7.33 | S1.1 39.19,1.45 59.87,1.45 60.98,2.56 60.98,6.4 v60.06,7.33 | v60.06,7.33 RESET-MEGA1.1
  other vias: 56.52,7.33
RESET-M2
  Top 0.33: MEGA2.29 65.27,18.65 65.51,18.41 65.51,16.56 65.25,16.31 65.25,15.62 64.54,14.91 64.54,14.22 69.22,9.55 M2-R1.1 RESET-MEGA2.1
  Top 0.406: RESET-MEGA2.1 RESET-MEGA2.2
  Bottom 0.33: RESET-MEGA2.1 73.66,5.35 73.66,2.54 71.96,0.84 36.75,0.84 36.04,1.55 36.04,4.42 36.7,5.08 S1.2
RO1  (via drill 0.35)
  Top 0.33: MEGA1.32 51.59,11.12 53.31,9.4 v53.31,9.37 | TO-UNDER.25 93.98,25.88 93.5,25.4 90.17,25.4 v86.36,21.59
  Bottom 0.33: v53.31,9.37 54.25,8.43 78.89,8.43 81.38,10.92 81.38,15.52 86.36,20.5 v86.36,21.59
RO2  (via drill 0.35)
  Top 0.33: MEGA2.32 63.5,15.46 63.5,13.92 v68.15,9.27 | TO-UNDER.26 90.32,26.67 87.71,24.05 86.59,22.94 v86.59,22.91
  Bottom 0.33: v86.59,22.91 85.7,22.02 85.7,20.52 80.9,15.72 80.9,11.12 78.69,8.92 68.5,8.92 v68.15,9.27
RXDM1
  Top 0.33: MEGA1.30 44.7,17.85 42.09,15.24 S1.6
RXDM2  (via drill 0.35)
  Top 0.33: MEGA2.30 v62.77,17.85 v62.76,17.86
  Bottom 0.33: v62.76,17.86 54.36,17.83 48.06,11.53 39.47,11.53 S1.4
RXDX1  (via drill 0.35)
  Top 0.33: U1.17 70.58,40.32 v70.18,40.72
  Bottom 0.33: v70.18,40.72 68.17,42.72 59.92,42.72 51,33.81 44.68,33.81 38.1,27.23 S1.8
SCK-M  (via drill 0.35)
  Top 0.33: MEGA2.17 71.38,24.45 71.09,24.74 68.58,24.74 66.9,26.42 SPI-SW.1 61.75,26.42 MEGA1.17 58.68,24.05 58.09,24.64 47.78,24.64 v47.62,24.49 | IC1.9 24.34,14.06 25.22,13.18 29.11,13.18 29.92,14 32.82,14 34.7,15.88 34.7,16.08 35.03,16.41 40.54,16.41 44.07,19.94 46.38,19.94 47.62,21.18 v47.62,22.81
  Bottom 0.33: v47.62,22.81 v47.62,24.49
SCK-X
  Top 0.33: U1.22 73.08,32.57 72.36,31.85 67,31.85 66.17,32.69 SPI-SW.6
SCKD
  Top 0.33: U1.32 89.36,43.99 TO-UNDER.14
SCKF
  Top 0.33: SPI-R.P$2 73.66,69.85 71.12,69.85 69.22,67.95 U2.6 69.22,63.58 69.57,63.22 73.66,63.22 74.09,62.79 74.09,55 U1.52
SCL-C
  Top 0.33: MPU.P$2 39.37,33.6 | 39.37,33.6 39.37,31.75 I2C-R.P$1 | U1.16 70.08,36.22 70.08,36.02 70.08,35.43 69.7,35.05 65.25,35.05 63.78,33.58 39.4,33.58 39.37,33.6
SCL-D
  Top 0.33: U1.26 84.74,40.99 TO-UNDER.20
  Bottom 0.33: LCD.3 87.63,24.13 87.63,30.48 TO-UNDER.20
SDA-C
  Top 0.33: I2C-R.P$2 36.83,31.75 MPU.P$3 36.83,37.59 37.36,38.12 40.11,38.12 40.59,37.64 40.59,35.38 41.91,34.06 63.58,34.06 65.05,35.53 69.49,35.53 69.58,35.62 U1.15
SDA-D
  Top 0.33: U1.25 85.09,38.99 91.19,32.89 93.75,32.89 93.98,32.66 TO-UNDER.21
  Bottom 0.33: TO-UNDER.21 92.71,30.48 90.17,30.48 88.9,29.21 88.9,13.97 90.17,12.7 LCD.4
SIG1  (via drill 0.35, 0.45)
  Top 0.33: U1.5 64.58,38.06 64.31,37.79 62.18,37.79 v61.75,38.23 | v55.12,26.8 55.47,27.15 v55.47,28.42 | MEGA1.1 53.08,15.56 54,16.48 54,19.86 v53.98,19.96
  Bottom 0.33: v61.75,38.23 60.76,38.23 55.63,33.1 55.63,28.57 v55.47,28.42 | v53.98,19.96 53.98,25.65 v55.12,26.8
SIG2  (via drill 0.35)
  Top 0.33: v66.9,17.2 65.78,16.07 MEGA2.1 | U1.6 65.08,38.02 v65.41,37.69
  Bottom 0.33: v66.9,17.2 67.31,17.6 67.31,21.44 65.38,23.37 65.38,24.49 64.03,25.83 64.03,28.09 65.23,29.29 65.23,35.48 65.41,35.66 v65.41,37.69
SS1  (via drill 0.35, 0.45)
  Top 0.33: U1.7 65.58,40.08 v65.15,40.51 | v64.26,29.34 62.52,29.34 SS-R1.1 | MEGA1.14 60.19,20.27 61.39,20.27 v61.8,19.86
  Bottom 0.33: v65.15,40.51 64.92,40.51 64.59,40.18 64.59,29.59 64.34,29.34 v64.26,29.34 63.5,28.57 63.5,25.4 64.77,24.13 64.77,23.09 66.65,21.21 66.65,19.46 66.17,18.97 62.66,18.97 61.82,19.81 61.82,19.84 v61.8,19.86
SS2  (via drill 0.45)
  Top 0.33: MEGA2.14 74.5,20.25 75.41,21.16 75.41,30.42 75.22,30.61 SS-R2.1 77.18,30.9 77.78,31.5 v77.78,37.06 | U1.8 66.08,40.02 v66.34,40.28
  Bottom 0.33: v77.78,37.06 77.32,37.52 70.43,37.52 67.67,40.28 v66.34,40.28
SS-R  (via drill 0.35, 0.45)
  Top 0.33: U1.49 79.16,52.49 v83.82,57.15 | v83.82,67.31 82.55,68.58 SPI-R.P$5
  Bottom 0.33: v83.82,57.15 v83.82,67.31
TCK
  Top 0.33: U1.11 67.58,37.12 66.96,36.5 56.11,36.5 55.73,36.5 55.09,35.86 JTAG.1
TDI
  Top 0.33: U1.10 67.08,40.95 66.67,41.35 62.97,41.35 61.34,39.73 56.77,39.73 55.55,40.95 JTAG.9
TDO
  Top 0.33: U1.12 68.08,36.91 67.18,36.02 56.31,36.02 54.84,34.54 52.43,34.54 51.71,35.25 51.71,36.55 52.3,37.13 JTAG.3
TMS
  Top 0.33: U1.9 66.58,37.47 66.09,36.98 57.15,36.98 56.62,36.98 56.24,36.98 55.5,37.72 55.37,37.85 54.81,38.4 JTAG.5
TXDM1
  Top 0.33: MEGA1.31 44.84,17.05 40.49,12.7 S1.5
TXDM2  (via drill 0.35)
  Top 0.33: MEGA2.31 v61.73,17.05 v61.72,17.04
  Bottom 0.33: v61.72,17.04 54.28,17.07 46.05,8.84 39.32,8.84 S1.3
TXDX1  (via drill 0.35)
  Top 0.33: v71.17,40.79 71.17,40.08 71.08,39.99 U1.18
  Bottom 0.33: S1.7 36.83,19.05 36.83,26.67 44.45,34.29 50.8,34.29 59.72,43.2 68.73,43.2 71.14,40.79 v71.17,40.79
X-RESET
  Top 0.33: RESET-XMEGA.1 RESET-XMEGA.2 96.86,78.81 X-R1.1 96.89,73.9 SV1.5 97.05,72.9 97.59,72.37 97.59,64.77 93.83,61.01 | 93.83,61.01 83.19,61.01 74.68,52.5 74.68,50.72 69.94,45.99 U1.90 54.63,45.99 51.59,42.95 51.59,38.84 51.16,38.4 JTAG.6 | 93.83,61.01 93.93,61.01 96.52,58.42 96.52,31.75 96.52,10.95 94.64,9.07 85.93,9.07 85.09,9.91 LCD.2
(copper drawn outside any net)
  shapes: Bottom area x2

### Text on the board
tPlace: 3.3 | 5 | 3.3 | 5 | G
tValues: 5 | G | 3.3 | G
_tValues: R | 3.3 | T | G
_bValues: 5V